# EAGLE design BlueBus (EAGLE 9.6.2)

## Sheet 1 of 5
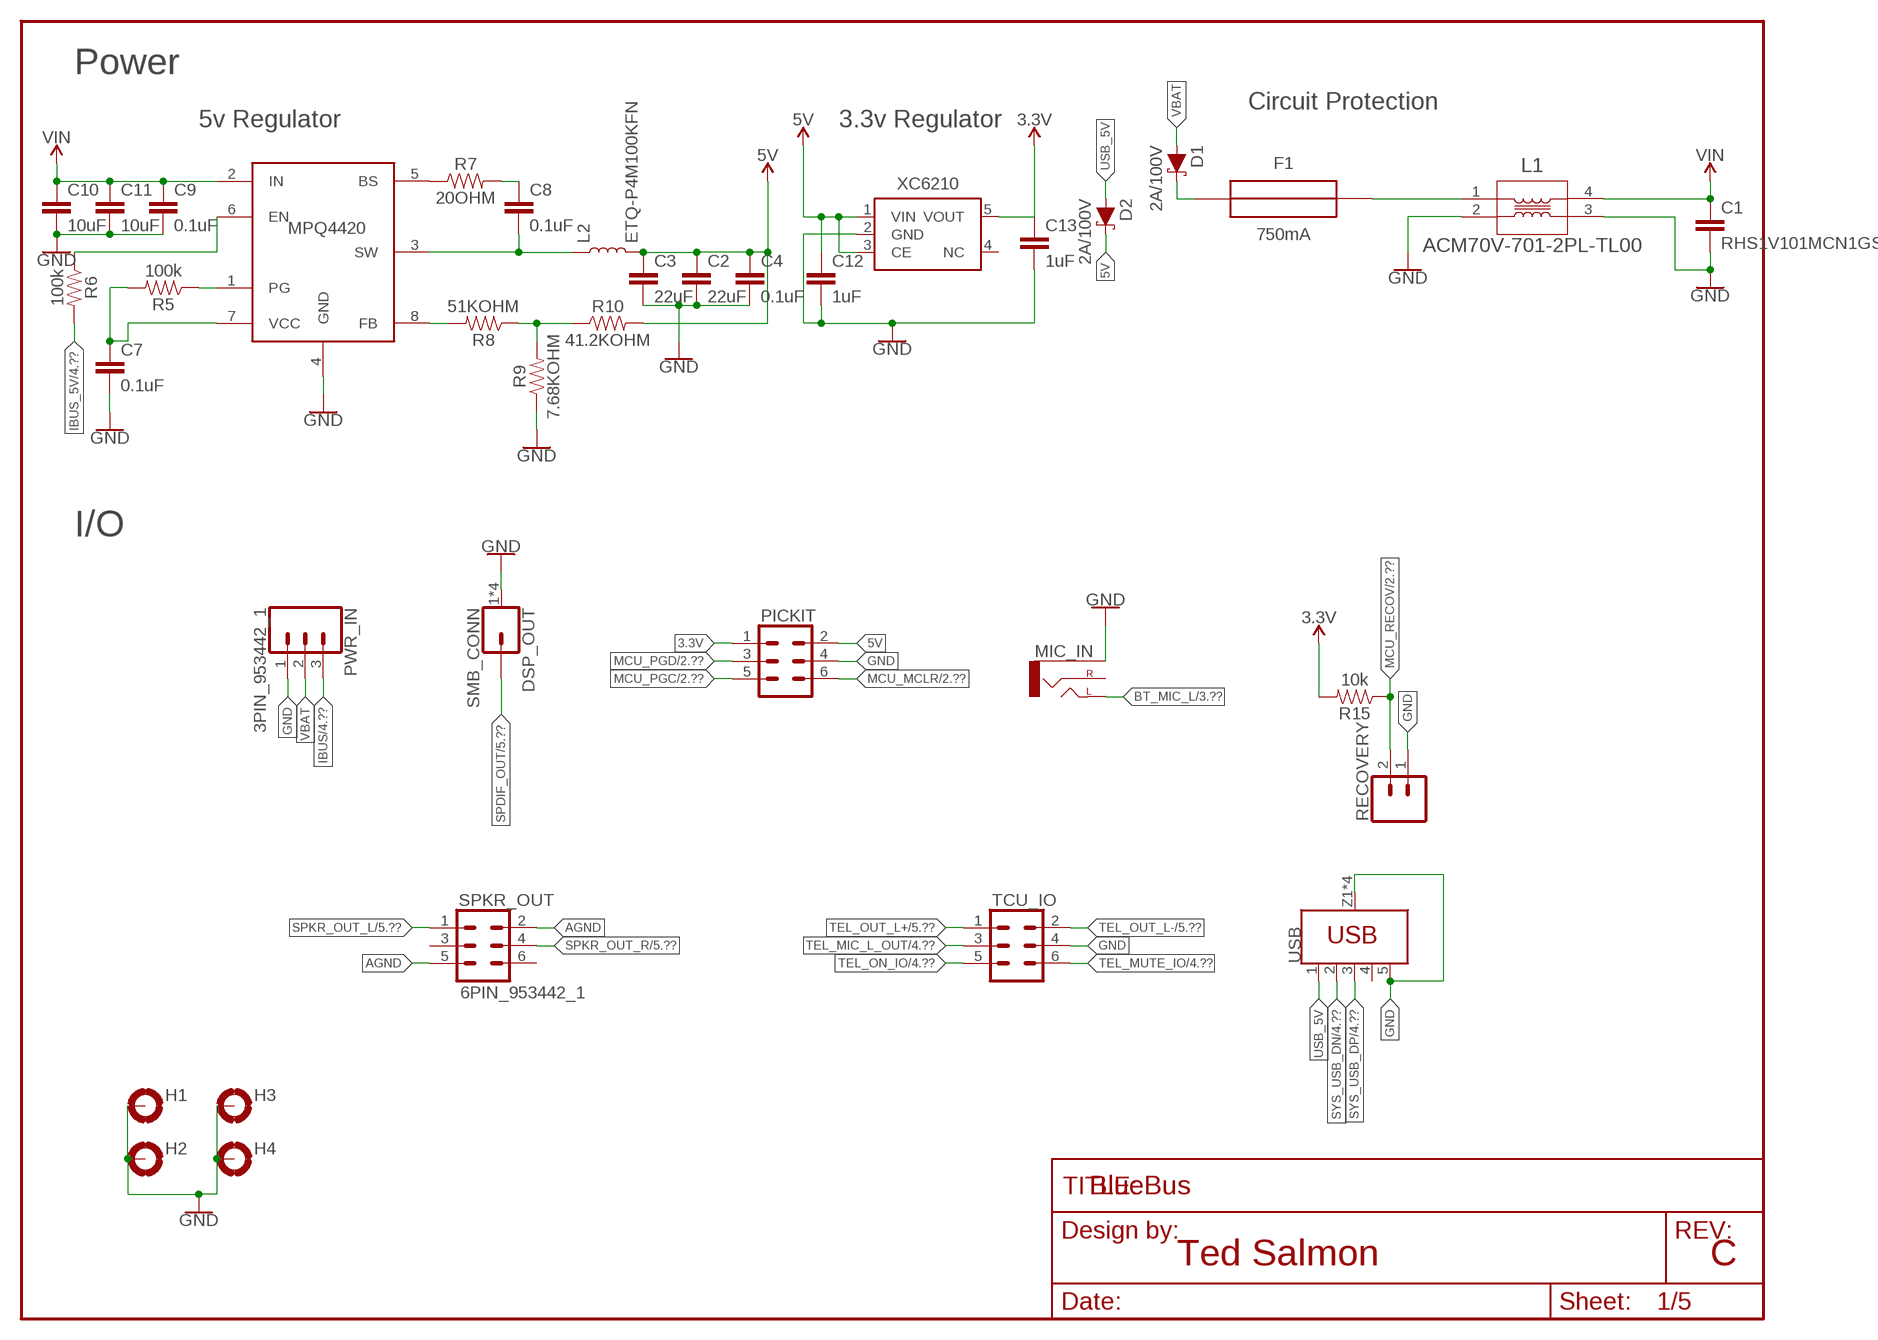
[diagram p0: schematic, sheet 1]

### Parts
C1  RHS1V101MCN1GS  [RHS1V101MCN1GS]
C2  22uF  22UF  [0805]
C3  22uF  22UF  [0805]
C4  0.1uF  0.1UF  [0805]
C7  0.1uF  0.1UF  [0805]
C8  0.1uF  0.1UF  [0805]
C9  0.1uF  0.1UF  [0805]
C10  10uF  10UF  [1206]
C11  10uF  10UF  [1206]
C12  1uF  1UF  [0805]
C13  1uF  1UF  [0805]
D1  2A/100V  SCHOTTKYDIODE2A100V  [SOD123]
D2  2A/100V  SCHOTTKYDIODE2A100V  [SOD123]
DSP_OUT  SMB_CONN  [MOLEX_SMB]
F1  750mA  LITTLEBLOCK_FUSE_.75A  [LITTLEFUSE]
FRAME1  FRAME-LETTER  [DUMMY]
H1  2,0-PAD  [2.0-PAD]
H2  2,0-PAD  [2.0-PAD]
H3  2,0-PAD  [2.0-PAD]
H4  2,0-PAD  [2.0-PAD]
L1  ACM70V-701-2PL-TL00  [ACM70V-701-2PL-TL00]
L2  ETQ-P4M100KFN  [PCC-M0648M-LE]
MIC_IN  AUDIO-CUI-SJ-3523-SMT  [AUDIO-CUI-SJ-352X-SMT]
MPQ4420  MPQ4420  [TSOT23-8]
PICKIT  6PIN_JUMPER  [2X3]
PWR_IN  3PIN_953442_1  [TE_MQS_3PIN]
R5  100k  100KOHM  [0805]
R6  100k  100KOHM  [0805]
R7  20OHM  [0805]
R8  51KOHM  [0805]
R9  7.68KOHM  [0805]
R10  41.2KOHM  [0805]
R15  10k  10KOHM  [0805]
RECOVERY  2PIN_JUMPER  [1X02]
SPKR_OUT  6PIN_953442_1  [TE_MQS_6PIN]
TCU_IO  6PIN_5_103166_1  [TE_AMPMODU_6_PIN]
USB  USB_WURTH_629105150521  [629105150521]
XC6210  XC6210SOT25  [SOT23-5]

### Nets
3.3V [3.3V]: C13.1 PICKIT.1 R15.2 XC6210.5(VOUT) ; also sheet 2,3,4,5
5V [USB_5V]: C2.1 C3.1 C4.1 C12.1 D2.C L2.2 PICKIT.2 R10.2 XC6210.1(VIN) XC6210.3(CE) ; also sheet 4,5
5VREG_BS: MPQ4420.5(BS) R7.1
5VREG_BS_CAP: C8.1 R7.2
5VREG_EN: MPQ4420.6(EN) R6.1
5VREG_FB: MPQ4420.8(FB) R8.2
5VREG_FB_T: R8.1 R9.2 R10.1
5VREG_PG: MPQ4420.1(PG) R5.1
5VREG_SW: C8.2 L2.1 MPQ4420.3(SW)
5VREG_VCC: C7.1 MPQ4420.7(VCC) R5.2
AGND: SPKR_OUT.2 SPKR_OUT.5 ; also sheet 5
BT_MIC_L: MIC_IN.TIP(LEFT) ; also sheet 3,4
GND: C1.2 C2.2 C3.2 C4.2 C7.2 C9.2 C10.2 C11.2 C12.2 C13.2 DSP_OUT.1(GND) DSP_OUT.2(GND) DSP_OUT.3(GND) DSP_OUT.4(GND) H1.B2,0(MOUNT) H2.B2,0(MOUNT) H3.B2,0(MOUNT) H4.B2,0(MOUNT) L1.2 L1.3 MIC_IN.SLEEVE MPQ4420.4(GND) PICKIT.4 PWR_IN.1 R9.1 RECOVERY.1 TCU_IO.4 USB.5(GND) USB.Z1(SHIELD) USB.Z2(SHIELD) USB.Z3(SHIELD) USB.Z4(SHIELD) XC6210.2(GND) ; also sheet 2,3,4,5
IBUS [Data]: PWR_IN.3 ; also sheet 4
IBUS_5V: R6.2 ; also sheet 4
MCU_MCLR [MCU_Data]: PICKIT.6 ; also sheet 2
MCU_PGC [MCU_Data]: PICKIT.5 ; also sheet 2
MCU_PGD [MCU_Data]: PICKIT.3 ; also sheet 2
MCU_RECOV [MCU_Data]: R15.1 RECOVERY.2 ; also sheet 2
SPDIF_OUT: DSP_OUT.P$1 ; also sheet 5
SPKR_OUT_L: SPKR_OUT.1 ; also sheet 5
SPKR_OUT_R: SPKR_OUT.4 ; also sheet 5
SYS_USB_DN [Data]: USB.2(D-) ; also sheet 4
SYS_USB_DP [Data]: USB.3(D+) ; also sheet 4
TEL_MIC_L_OUT: TCU_IO.3 ; also sheet 4
TEL_MUTE_IO: TCU_IO.6 ; also sheet 4
TEL_ON_IO: TCU_IO.5 ; also sheet 4
TEL_OUT_L+: TCU_IO.1 ; also sheet 5
TEL_OUT_L-: TCU_IO.2 ; also sheet 5
USB_5V: D2.A USB.1(VBUS)
VBAT: D1.A PWR_IN.2
VBAT_DIODE: D1.C F1.IN(OUT)
VBAT_FUSE: F1.OUT(IN) L1.1
VIN [VIN]: C1.1 C9.1 C10.1 C11.1 L1.4 MPQ4420.2(IN) ; also sheet 4
Unconnected: MIC_IN.RING(RIGHT) SPKR_OUT.3 SPKR_OUT.6 USB.4(ID) XC6210.4(NC)

### Notes on the sheet
- Power
- Circuit Protection
- 5v Regulator | 3.3v Regulator
- I/O
- Ted Salmon | C

## Sheet 2 of 5
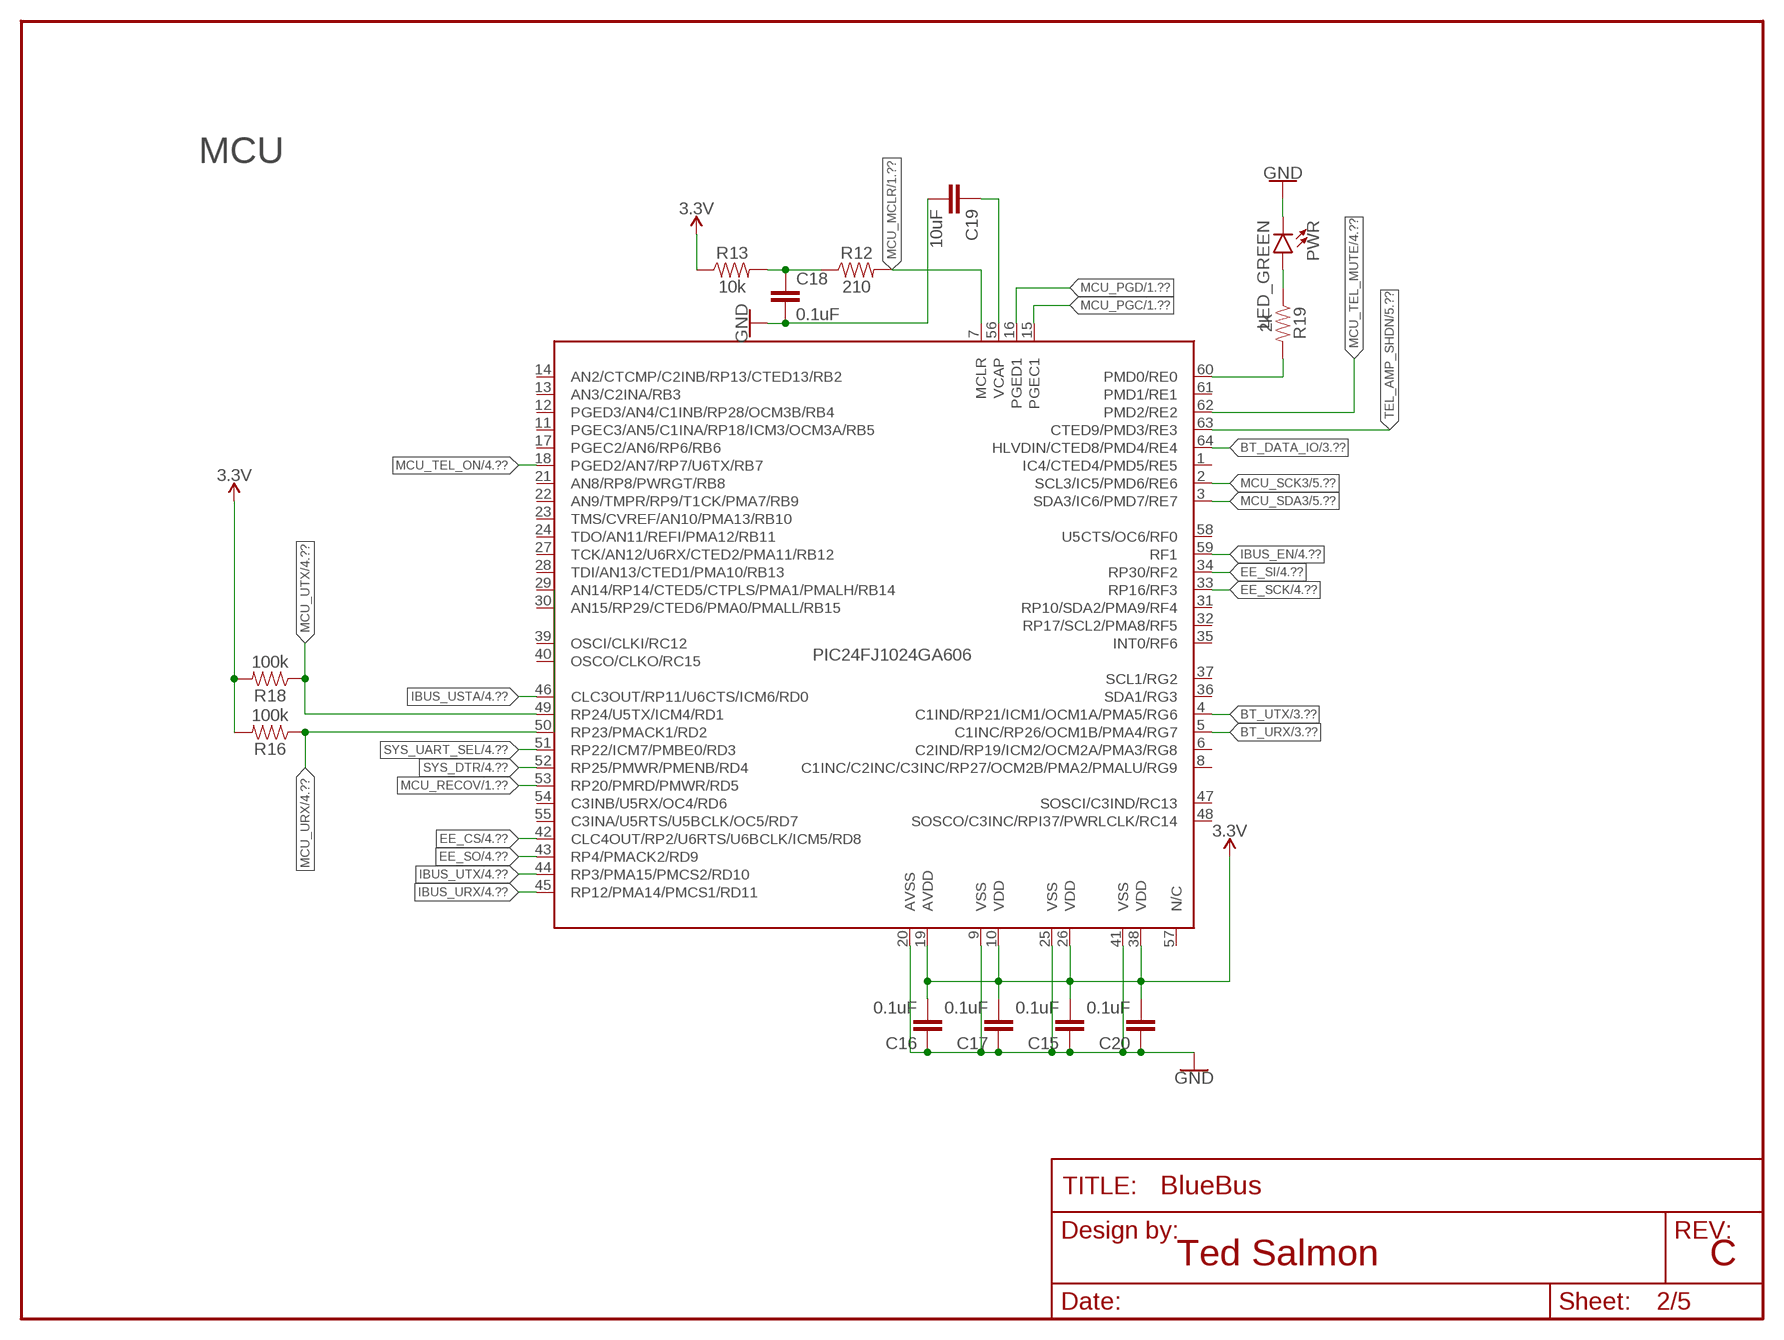
[diagram p1: schematic, sheet 2]

### Parts
C15  0.1uF  0.1UF  [0805]
C16  0.1uF  0.1UF  [0805]
C17  0.1uF  0.1UF  [0805]
C18  0.1uF  0.1UF  [0805]
C19  10uF  10UF2012  [0805]
C20  0.1uF  0.1UF  [0805]
FRAME2  FRAME-LETTER  [DUMMY]
PIC24FJ1024GA606  PIC24FJ1024GA606  [TQFP64]
PWR  LED_GREEN  [LED-0805]
R12  210  210OHM  [0805]
R13  10k  10KOHM  [0805]
R16  100k  100KOHM  [0805]
R18  100k  100KOHM  [0805]
R19  2k  2KOHM  [0805]

### Nets
3.3V [3.3V]: C15.2 C16.2 C17.2 C20.2 PIC24FJ1024GA606.10(VDD) PIC24FJ1024GA606.19(AVDD) PIC24FJ1024GA606.26(VDD) PIC24FJ1024GA606.38(VDD) R13.1 R16.2 R18.2 ; also sheet 1,3,4,5
BT_DATA_IO [MCU_Data]: PIC24FJ1024GA606.64(HLVDIN/CTED8/PMD4/RE4) ; also sheet 3
BT_URX [MCU_Data]: PIC24FJ1024GA606.5(C1INC/RP26/OCM1B/PMA4/RG7) ; also sheet 3,4
BT_UTX [MCU_Data]: PIC24FJ1024GA606.4(C1IND/RP21/ICM1/OCM1A/PMA5/RG6) ; also sheet 3,4
EE_CS [MCU_Data]: PIC24FJ1024GA606.42(CLC4OUT/RP2/U6RTS/U6BCLK/ICM5/RD8) ; also sheet 4
EE_SCK [MCU_Data]: PIC24FJ1024GA606.33(RP16/RF3) ; also sheet 4
EE_SI [MCU_Data]: PIC24FJ1024GA606.34(RP30/RF2) ; also sheet 4
EE_SO [MCU_Data]: PIC24FJ1024GA606.43(RP4/PMACK2/RD9) ; also sheet 4
GND: C15.1 C16.1 C17.1 C18.2 C19.2 C20.1 PIC24FJ1024GA606.9(VSS) PIC24FJ1024GA606.20(AVSS) PIC24FJ1024GA606.25(VSS) PIC24FJ1024GA606.41(VSS) PWR.-(C) ; also sheet 1,3,4,5
IBUS_EN [MCU_Data]: PIC24FJ1024GA606.59(RF1) ; also sheet 4
IBUS_URX [MCU_Data]: PIC24FJ1024GA606.45(RP12/PMA14/PMCS1/RD11) ; also sheet 4
IBUS_USTA [MCU_Data]: PIC24FJ1024GA606.46(CLC3OUT/RP11/U6CTS/ICM6/RD0) ; also sheet 4
IBUS_UTX [MCU_Data]: PIC24FJ1024GA606.44(RP3/PMA15/PMCS2/RD10) ; also sheet 4
MCU_MCLR [MCU_Data]: PIC24FJ1024GA606.7(MCLR) R12.2 ; also sheet 1
MCU_MCLR_RES [MCU_Data]: C18.1 R12.1 R13.2
MCU_ON_LED [MCU_Data]: PIC24FJ1024GA606.60(PMD0/RE0) R19.2
MCU_ON_LED_RES: PWR.+(A) R19.1
MCU_PGC [MCU_Data]: PIC24FJ1024GA606.15(PGEC1) ; also sheet 1
MCU_PGD [MCU_Data]: PIC24FJ1024GA606.16(PGED1) ; also sheet 1
MCU_RECOV [MCU_Data]: PIC24FJ1024GA606.53(RP20/PMRD/PMWR/RD5) ; also sheet 1
MCU_SCK3 [MCU_Data]: PIC24FJ1024GA606.2(SCL3/IC5/PMD6/RE6) ; also sheet 5
MCU_SDA3 [MCU_Data]: PIC24FJ1024GA606.3(SDA3/IC6/PMD7/RE7) ; also sheet 5
MCU_TEL_MUTE [MCU_Data]: PIC24FJ1024GA606.62(PMD2/RE2) ; also sheet 4
MCU_TEL_ON [MCU_Data]: PIC24FJ1024GA606.18(PGED2/AN7/RP7/U6TX/RB7) ; also sheet 4
MCU_URX [MCU_Data]: PIC24FJ1024GA606.50(RP23/PMACK1/RD2) R16.1 ; also sheet 4
MCU_UTX [MCU_Data]: PIC24FJ1024GA606.49(RP24/U5TX/ICM4/RD1) R18.1 ; also sheet 4
MCU_VCAP [MCU_Data]: C19.1 PIC24FJ1024GA606.56(VCAP)
SYS_DTR [MCU_Data]: PIC24FJ1024GA606.52(RP25/PMWR/PMENB/RD4) ; also sheet 4
SYS_UART_SEL [MCU_Data]: PIC24FJ1024GA606.51(RP22/ICM7/PMBE0/RD3) ; also sheet 4
TEL_AMP_SHDN [MCU_Data]: PIC24FJ1024GA606.63(CTED9/PMD3/RE3) ; also sheet 5
Unconnected: PIC24FJ1024GA606.1(IC4/CTED4/PMD5/RE5) PIC24FJ1024GA606.6(C2IND/RP19/ICM2/OCM2A/PMA3/RG8) PIC24FJ1024GA606.8(C1INC/C2INC/C3INC/RP27/OCM2B/PMA2/PMALU/RG9) PIC24FJ1024GA606.11(PGEC3/AN5/C1INA/RP18/ICM3/OCM3A/RB5) PIC24FJ1024GA606.12(PGED3/AN4/C1INB/RP28/OCM3B/RB4) PIC24FJ1024GA606.13(AN3/C2INA/RB3) PIC24FJ1024GA606.14(AN2/CTCMP/C2INB/RP13/CTED13/RB2) PIC24FJ1024GA606.17(PGEC2/AN6/RP6/RB6) PIC24FJ1024GA606.21(AN8/RP8/PWRGT/RB8) PIC24FJ1024GA606.22(AN9/TMPR/RP9/T1CK/PMA7/RB9) PIC24FJ1024GA606.23(TMS/CVREF/AN10/PMA13/RB10) PIC24FJ1024GA606.24(TDO/AN11/REFI/PMA12/RB11) PIC24FJ1024GA606.27(TCK/AN12/U6RX/CTED2/PMA11/RB12) PIC24FJ1024GA606.28(TDI/AN13/CTED1/PMA10/RB13) PIC24FJ1024GA606.29(AN14/RP14/CTED5/CTPLS/PMA1/PMALH/RB14) PIC24FJ1024GA606.30(AN15/RP29/CTED6/PMA0/PMALL/RB15) PIC24FJ1024GA606.31(RP10/SDA2/PMA9/RF4) PIC24FJ1024GA606.32(RP17/SCL2/PMA8/RF5) PIC24FJ1024GA606.35(INT0/RF6) PIC24FJ1024GA606.36(SDA1/RG3) PIC24FJ1024GA606.37(SCL1/RG2) PIC24FJ1024GA606.39(OSCI/CLKI/RC12) PIC24FJ1024GA606.40(OSCO/CLKO/RC15) PIC24FJ1024GA606.47(SOSCI/C3IND/RC13) PIC24FJ1024GA606.48(SOSCO/C3INC/RPI37/PWRLCLK/RC14) PIC24FJ1024GA606.54(C3INB/U5RX/OC4/RD6) PIC24FJ1024GA606.55(C3INA/U5RTS/U5BCLK/OC5/RD7) PIC24FJ1024GA606.57(N/C) PIC24FJ1024GA606.58(U5CTS/OC6/RF0) PIC24FJ1024GA606.61(PMD1/RE1)

### Notes on the sheet
- MCU
- Ted Salmon | C

## Sheet 3 of 5
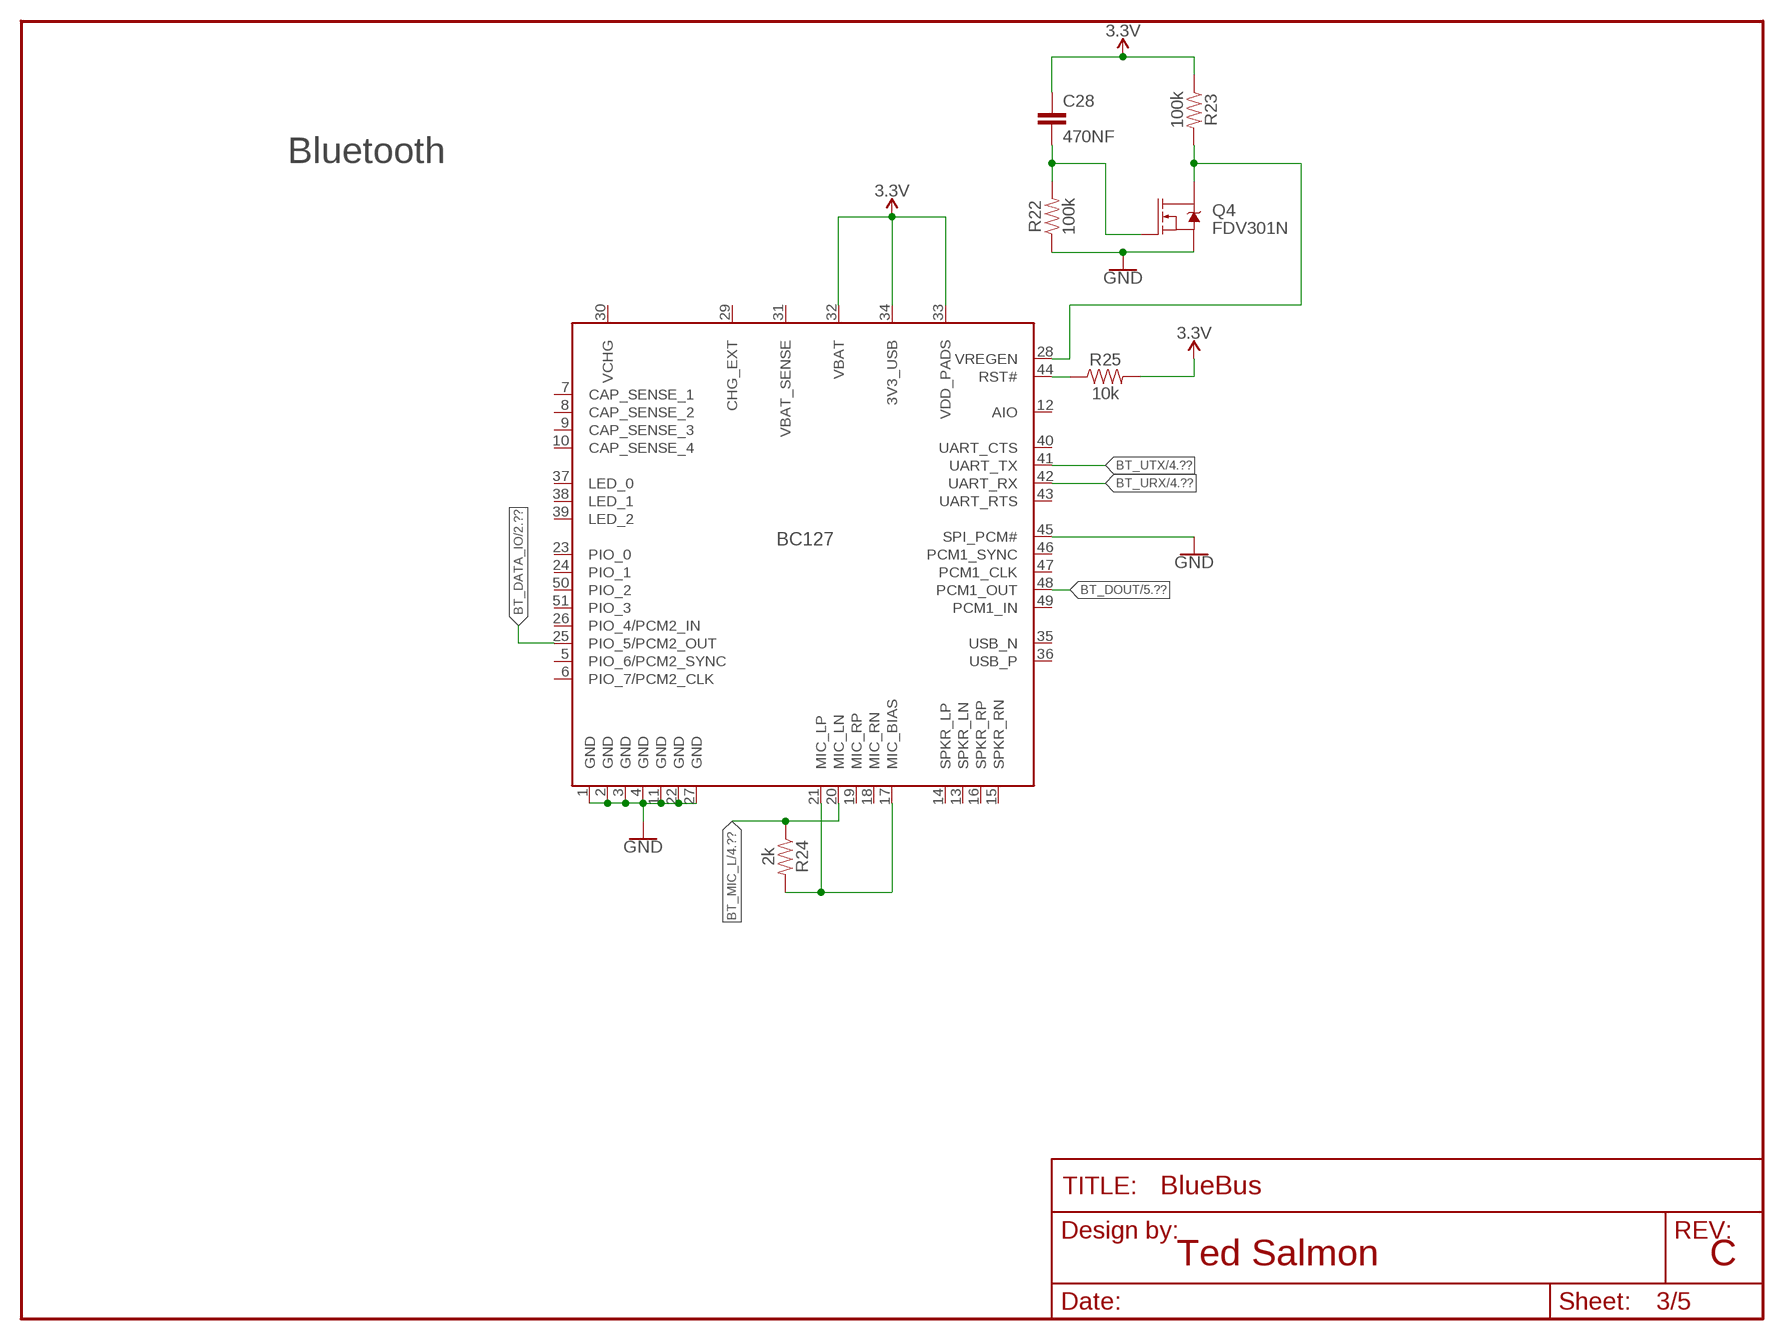
[diagram p2: schematic, sheet 3]

### Parts
BC127  BC127  [BC127]
C28  470NF  [0805]
FRAME4  FRAME-LETTER  [DUMMY]
Q4  FDV301N  [SOT-23]
R22  100k  100KOHM  [0805]
R23  100k  100KOHM  [0805]
R24  2k  2KOHM  [0805]
R25  10k  10KOHM  [0805]

### Nets
3.3V [3.3V]: BC127.32(VBAT) BC127.33(VDD_PADS) BC127.34(3V3_USB) C28.1 R23.1 R25.2 ; also sheet 1,2,4,5
BT_DATA_IO [MCU_Data]: BC127.25(PIO_5/PCM2_OUT) ; also sheet 2
BT_DOUT: BC127.48(PCM1_OUT) ; also sheet 5
BT_MIC_BIAS: BC127.17(MIC_BIAS) BC127.21(MIC_LP) R24.2
BT_MIC_L: BC127.20(MIC_LN) R24.1 ; also sheet 1,4
BT_RST: BC127.44(RST#) R25.1
BT_URX [MCU_Data]: BC127.42(UART_RX) ; also sheet 2,4
BT_UTX [MCU_Data]: BC127.41(UART_TX) ; also sheet 2,4
BT_VREGEN: BC127.28(VREGEN) Q4.3(D) R23.2
BT_VREGEN_CAP_GATE: C28.2 Q4.1(G) R22.2
GND: BC127.1(GND) BC127.2(GND) BC127.3(GND) BC127.4(GND) BC127.11(GND) BC127.22(GND) BC127.27(GND) BC127.45(SPI_PCM#) Q4.2(S) R22.1 ; also sheet 1,2,4,5
Unconnected: BC127.5(PIO_6/PCM2_SYNC) BC127.6(PIO_7/PCM2_CLK) BC127.7(CAP_SENSE_1) BC127.8(CAP_SENSE_2) BC127.9(CAP_SENSE_3) BC127.10(CAP_SENSE_4) BC127.12(AIO) BC127.13(SPKR_LN) BC127.14(SPKR_LP) BC127.15(SPKR_RN) BC127.16(SPKR_RP) BC127.18(MIC_RN) BC127.19(MIC_RP) BC127.23(PIO_0) BC127.24(PIO_1) BC127.26(PIO_4/PCM2_IN) BC127.35(USB_N) BC127.36(USB_P) BC127.37(LED_0) BC127.38(LED_1) BC127.39(LED_2) BC127.40(UART_CTS) BC127.43(UART_RTS) BC127.46(PCM1_SYNC) BC127.47(PCM1_CLK) BC127.49(PCM1_IN) BC127.50(PIO_2) BC127.51(PIO_3)

### Notes on the sheet
- Bluetooth
- Ted Salmon | C

## Sheet 4 of 5
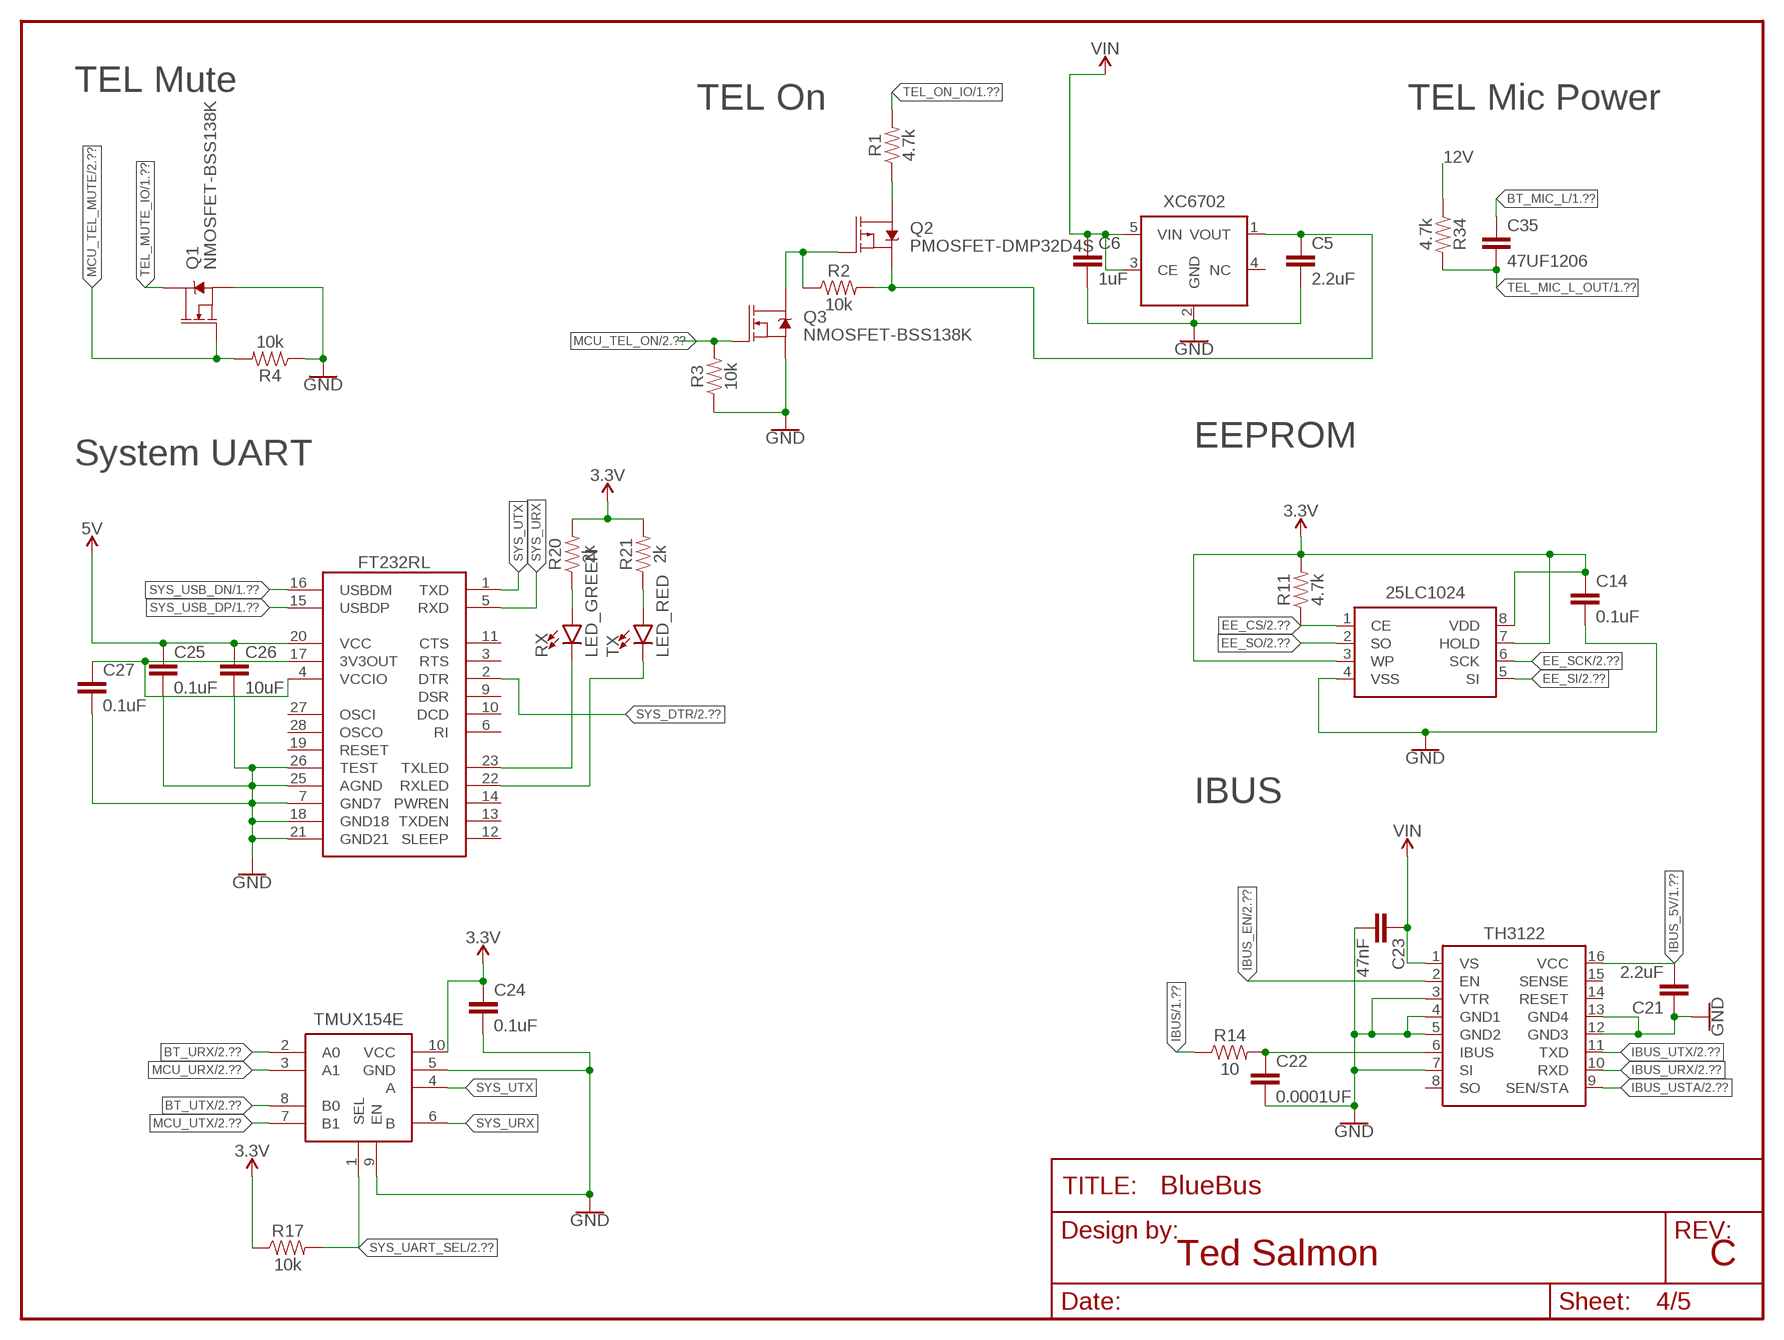
[diagram p3: schematic, sheet 4]

### Parts
25LC1024  25LC1024  [SOIJ-8]
C5  2.2uF  2.2UF  [0805]
C6  1uF  1UF  [0805]
C14  0.1uF  0.1UF  [0805]
C21  2.2uF  2.2UF  [0805]
C22  0.0001UF  [0805]
C23  47nF  47NF  [0805]
C24  0.1uF  0.1UF  [0805]
C25  0.1uF  0.1UF  [0805]
C26  10uF  10UF2012  [0805]
C27  0.1uF  0.1UF  [0805]
C35  47UF1206  [1206]
FRAME3  FRAME-LETTER  [DUMMY]
FT232RL  FT232RL  [SSOP28]
Q1  NMOSFET-BSS138K  [SOT-23]
Q2  PMOSFET-DMP32D4S  [SOT-23]
Q3  NMOSFET-BSS138K  [SOT-23]
R1  4.7k  4.7KOHM  [0805]
R2  10k  10KOHM  [0805]
R3  10k  10KOHM  [0805]
R4  10k  10KOHM  [0805]
R11  4.7k  4.7KOHM  [0805]
R14  10  10OHM  [0805]
R17  10k  10KOHM  [0805]
R20  2k  2KOHM  [0805]
R21  2k  2KOHM  [0805]
R34  4.7k  4.7KOHM  [0805]
RX  LED_GREEN  [LED-0805]
TH3122  TH3122.4  [SOIC16DF]
TMUX154E  TMUX154E  [VSSOP10]
TX  LED_RED  [LED-0805]
XC6702  XC6702DC018PR-G  [SOT-89-5]

### Nets
3.3V [3.3V]: 25LC1024.3(WP) 25LC1024.7(HOLD) 25LC1024.8(VDD) C14.1 C24.1 R11.2 R17.1 R20.2 R21.2 TMUX154E.10(VCC) ; also sheet 1,2,3,5
5V [USB_5V]: C25.1 C26.1 FT232RL.20(VCC) ; also sheet 1,5
12V [VIN]: C5.1 Q2.2(S) R2.2 R34.1 XC6702.1(VOUT)
BT_MIC_L: C35.1 ; also sheet 1,3
BT_URX [MCU_Data]: TMUX154E.2(A0) ; also sheet 2,3
BT_UTX [MCU_Data]: TMUX154E.8(B0) ; also sheet 2,3
EE_CS [MCU_Data]: 25LC1024.1(CE) R11.1 ; also sheet 2
EE_SCK [MCU_Data]: 25LC1024.6(SCK) ; also sheet 2
EE_SI [MCU_Data]: 25LC1024.5(SI) ; also sheet 2
EE_SO [MCU_Data]: 25LC1024.2(SO) ; also sheet 2
GND: 25LC1024.4(VSS) C5.2 C6.2 C14.2 C21.1 C22.2 C23.2 C24.2 C25.2 C26.2 C27.2 FT232RL.7(GND7) FT232RL.18(GND18) FT232RL.21(GND21) FT232RL.25(AGND) FT232RL.26(TEST) Q1.2(S) Q3.2(S) R3.1 R4.1 TH3122.3(VTR) TH3122.4(GND1) TH3122.5(GND2) TH3122.7(SI) TH3122.12(GND3) TH3122.13(GND4) TMUX154E.5(GND) TMUX154E.9(EN) XC6702.2(GND) ; also sheet 1,2,3,5
IBUS [Data]: R14.1 ; also sheet 1
IBUS_5V: C21.2 TH3122.16(VCC) ; also sheet 1
IBUS_EN [MCU_Data]: TH3122.2(EN) ; also sheet 2
IBUS_FILT: C22.1 R14.2 TH3122.6(IBUS)
IBUS_URX [MCU_Data]: TH3122.10(RXD) ; also sheet 2
IBUS_USTA [MCU_Data]: TH3122.9(SEN/STA) ; also sheet 2
IBUS_UTX [MCU_Data]: TH3122.11(TXD) ; also sheet 2
MCU_TEL_MUTE [MCU_Data]: Q1.1(G) R4.2 ; also sheet 2
MCU_TEL_ON [MCU_Data]: Q3.1(G) R3.2 ; also sheet 2
MCU_URX [MCU_Data]: TMUX154E.3(A1) ; also sheet 2
MCU_UTX [MCU_Data]: TMUX154E.7(B1) ; also sheet 2
RX_LED: FT232RL.23(TXLED) RX.-(C)
RX_LED_RES: R20.1 RX.+(A)
SYS_3V3: C27.1 FT232RL.4(VCCIO) FT232RL.17(3V3OUT)
SYS_DTR [MCU_Data]: FT232RL.2(DTR) ; also sheet 2
SYS_UART_SEL [MCU_Data]: R17.2 TMUX154E.1(SEL) ; also sheet 2
SYS_URX: FT232RL.5(RXD) TMUX154E.6(B)
SYS_USB_DN [Data]: FT232RL.16(USBDM) ; also sheet 1
SYS_USB_DP [Data]: FT232RL.15(USBDP) ; also sheet 1
SYS_UTX: FT232RL.1(TXD) TMUX154E.4(A)
TEL_MIC_L_OUT: C35.2 R34.2 ; also sheet 1
TEL_MUTE_IO: Q1.3(D) ; also sheet 1
TEL_ON: Q2.3(D) R1.1
TEL_ON_EN: Q2.1(G) Q3.3(D) R2.1
TEL_ON_IO: R1.2 ; also sheet 1
TX_LED: FT232RL.22(RXLED) TX.-(C)
TX_LED_RES: R21.1 TX.+(A)
VIN [VIN]: C6.1 C23.1 TH3122.1(VS) XC6702.3(CE) XC6702.5(VIN) ; also sheet 1
Unconnected: FT232RL.3(RTS) FT232RL.6(RI) FT232RL.9(DSR) FT232RL.10(DCD) FT232RL.11(CTS) FT232RL.12(SLEEP) FT232RL.13(TXDEN) FT232RL.14(PWREN) FT232RL.19(RESET) FT232RL.27(OSCI) FT232RL.28(OSCO) TH3122.8(SO) TH3122.14(RESET) TH3122.15(SENSE) XC6702.4(NC)

### Notes on the sheet
- TEL Mute
- TEL On | TEL Mic Power
- EEPROM
- System UART
- IBUS
- Ted Salmon | C

## Sheet 5 of 5
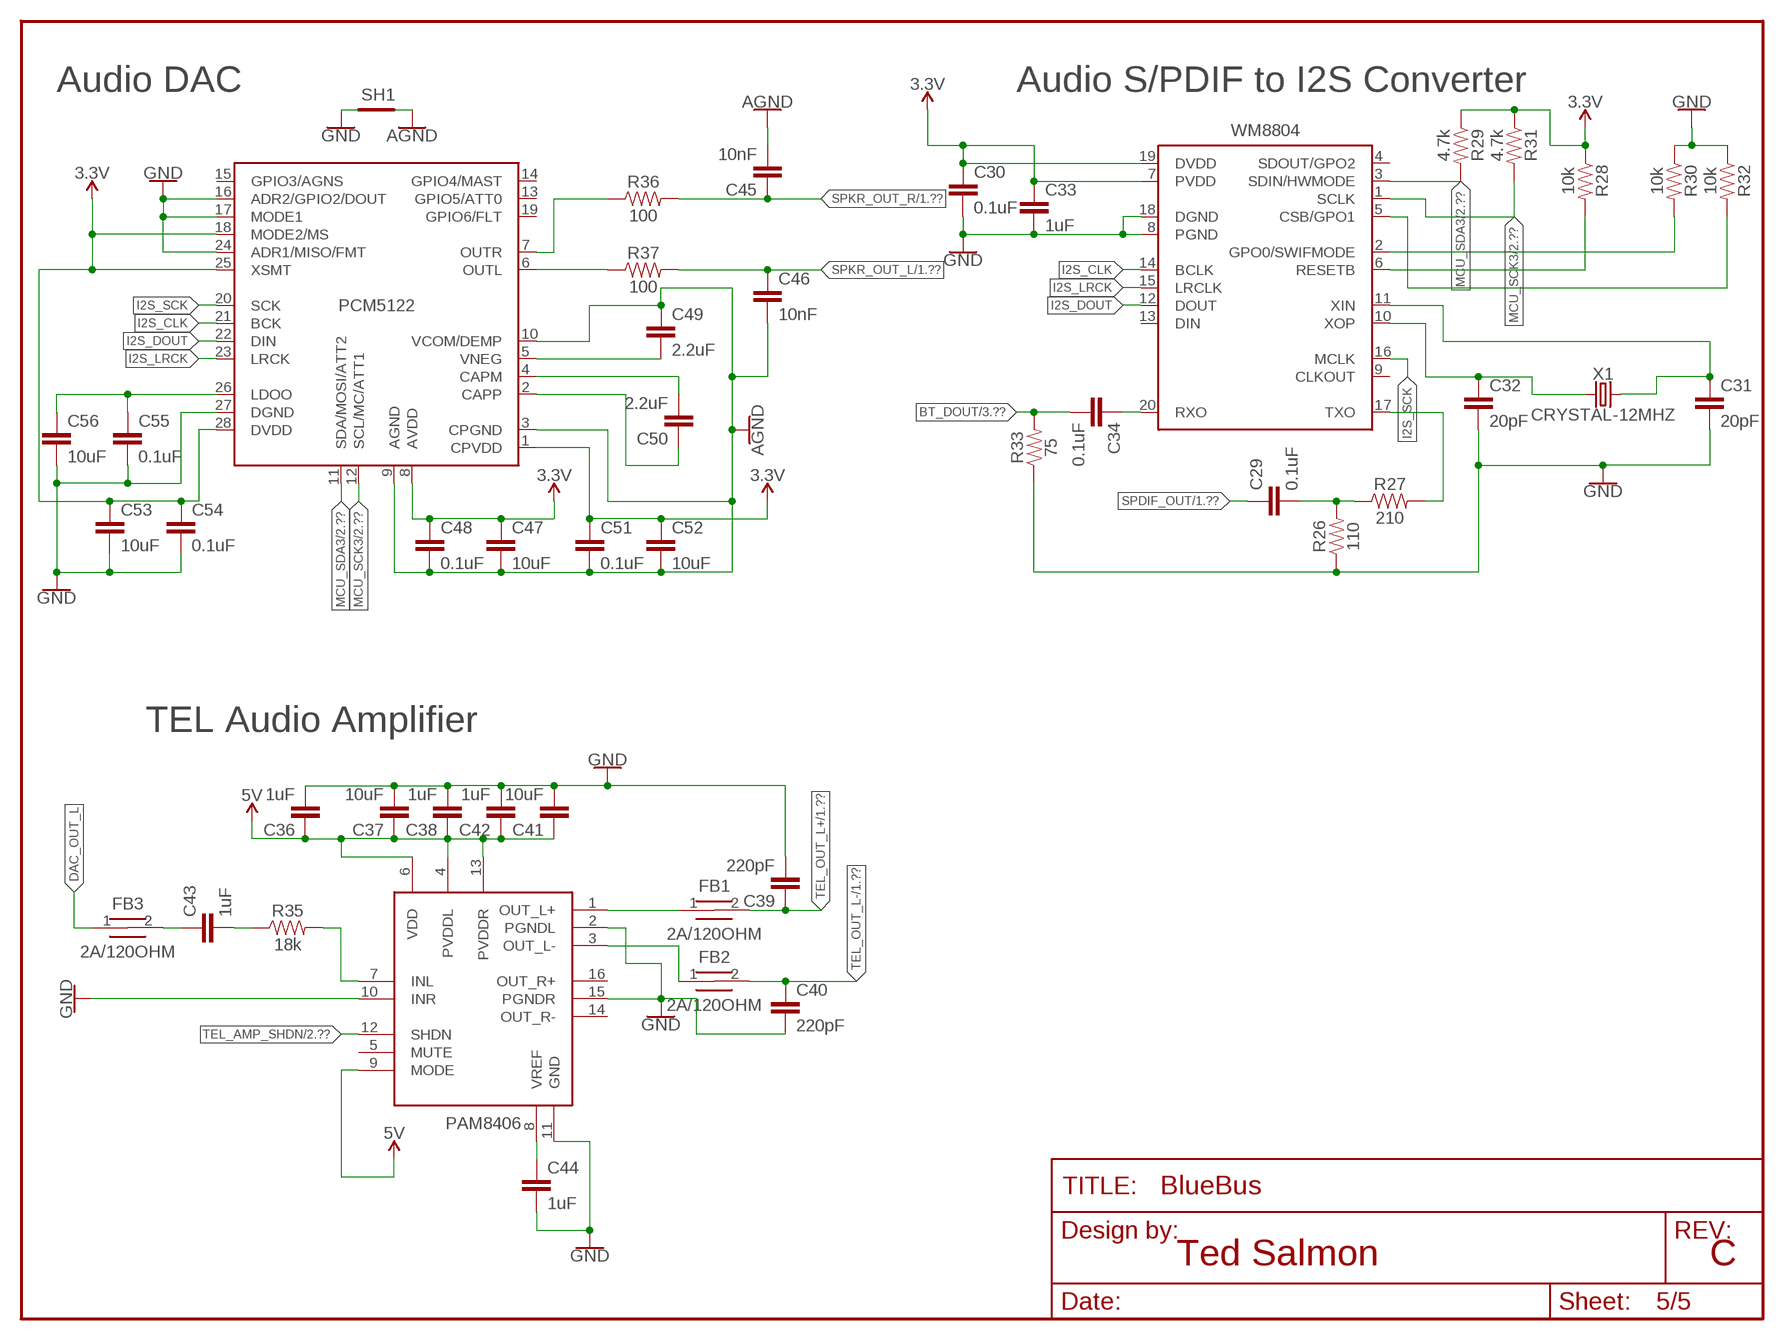
[diagram p4: schematic, sheet 5]

### Parts
C29  0.1uF  0.1UF  [0805]
C30  0.1uF  0.1UF  [0805]
C31  20pF  20PF  [0805]
C32  20pF  20PF  [0805]
C33  1uF  1UF  [0805]
C34  0.1uF  0.1UF  [0805]
C36  1uF  1UF  [0805]
C37  10uF  10UF2012  [0805]
C38  1uF  1UF  [0805]
C39  220pF  220PF  [0805]
C40  220pF  220PF  [0805]
C41  10uF  10UF2012  [0805]
C42  1uF  1UF  [0805]
C43  1uF  1UF  [0805]
C44  1uF  1UF  [0805]
C45  10nF  10NF  [0805]
C46  10nF  10NF  [0805]
C47  10uF  10UF2012  [0805]
C48  0.1uF  0.1UF  [0805]
C49  2.2uF  2.2UF  [0805]
C50  2.2uF  2.2UF  [0805]
C51  0.1uF  0.1UF  [0805]
C52  10uF  10UF2012  [0805]
C53  10uF  10UF2012  [0805]
C54  0.1uF  0.1UF  [0805]
C55  0.1uF  0.1UF  [0805]
C56  10uF  10UF2012  [0805]
FB1  2A/120OHM  FERRITE_2A/120OHM  [0805]
FB2  2A/120OHM  FERRITE_2A/120OHM  [0805]
FB3  2A/120OHM  FERRITE_2A/120OHM  [0805]
FRAME5  FRAME-LETTER  [DUMMY]
PAM8406  PAM8406  [SOP-16]
PCM5122  PCM5122  [TSSOP28]
R26  110  110OHM  [0805]
R27  210  210OHM  [0805]
R28  10k  10KOHM  [0805]
R29  4.7k  4.7KOHM  [0805]
R30  10k  10KOHM  [0805]
R31  4.7k  4.7KOHM  [0805]
R32  10k  10KOHM  [0805]
R33  75  75OHM  [0805]
R35  18k  18KOHM  [0805]
R36  100  100OHM  [0805]
R37  100  100OHM  [0805]
SH1  SHORTT5  [SHORT_TOP-50]
WM8804  WM8804  [SSOP20]
X1  CRYSTAL-12MHZ  [HC49]

### Nets
3.3V [3.3V]: C30.1 C33.1 C47.1 C48.1 C51.1 C52.1 C53.1 C54.1 PCM5122.1(CPVDD) PCM5122.8(AVDD) PCM5122.18(MODE2/MS) PCM5122.25(XSMT) PCM5122.28(DVDD) R28.1 R29.1 R31.1 WM8804.7(PVDD) WM8804.19(DVDD) ; also sheet 1,2,3,4
5V [USB_5V]: C36.1 C37.1 C38.1 C41.1 C42.1 PAM8406.4(PVDDL) PAM8406.6(VDD) PAM8406.9(MODE) PAM8406.13(PVDDR) ; also sheet 1,4
AGND: C45.2 C46.2 C47.2 C48.2 C49.1 C51.2 C52.2 PCM5122.3(CPGND) PCM5122.9(AGND) PCM5122.10(VCOM/DEMP) SH1.2 ; also sheet 1
BT_DOUT: C34.2 R33.2 ; also sheet 3
DAC_CAPM: C50.2 PCM5122.4(CAPM)
DAC_CAPP: C50.1 PCM5122.2(CAPP)
DAC_LDOO: C55.1 C56.1 PCM5122.26(LDOO)
DAC_OUT_L: FB3.1 PCM5122.6(OUTL) R37.1
DAC_OUT_R: PCM5122.7(OUTR) R36.1
DAC_VNEG: C49.2 PCM5122.5(VNEG)
GND: C30.2 C31.2 C32.2 C33.2 C36.2 C37.2 C38.2 C39.2 C40.2 C41.2 C42.2 C44.2 C53.2 C54.2 C55.2 C56.2 PAM8406.2(PGNDL) PAM8406.10(INR) PAM8406.11(GND) PAM8406.15(PGNDR) PCM5122.16(ADR2/GPIO2/DOUT) PCM5122.17(MODE1) PCM5122.24(ADR1/MISO/FMT) PCM5122.27(DGND) R26.1 R30.1 R32.1 R33.1 SH1.1 WM8804.8(PGND) WM8804.18(DGND) ; also sheet 1,2,3,4
I2S_CLK: PCM5122.21(BCK) WM8804.14(BCLK)
I2S_DOUT: PCM5122.22(DIN) WM8804.12(DOUT)
I2S_LRCK: PCM5122.23(LRCK) WM8804.15(LRCLK)
I2S_SCK: PCM5122.20(SCK) WM8804.16(MCLK)
MCU_SCK3 [MCU_Data]: PCM5122.12(SCL/MC/ATT1) R31.2 WM8804.1(SCLK) ; also sheet 2
MCU_SDA3 [MCU_Data]: PCM5122.11(SDA/MOSI/ATT2) R29.2 WM8804.3(SDIN/HWMODE) ; also sheet 2
SPDIF_OUT: C29.1 ; also sheet 1
SPDIF_RX: C34.1 WM8804.20(RXO)
SPKR_OUT_L: C46.1 R37.2 ; also sheet 1
SPKR_OUT_R: C45.1 R36.2 ; also sheet 1
TEL_AMP_IN: C43.1 FB3.2
TEL_AMP_INL: PAM8406.7(INL) R35.2
TEL_AMP_INL_CAP_RES: C43.2 R35.1
TEL_AMP_OUT_L+: FB1.1 PAM8406.1(OUT_L+)
TEL_AMP_OUT_L-: FB2.1 PAM8406.3(OUT_L-)
TEL_AMP_SHDN [MCU_Data]: PAM8406.12(SHDN) ; also sheet 2
TEL_AMP_VREF: C44.1 PAM8406.8(VREF)
TEL_OUT_L+: C39.1 FB1.2 ; also sheet 1
TEL_OUT_L-: C40.1 FB2.2 ; also sheet 1
WM_CSB: R32.2 WM8804.5(CSB/GPO1)
WM_GPO0: R30.2 WM8804.2(GPO0/SWIFMODE)
WM_RESETB: R28.2 WM8804.6(RESETB)
WM_SPDIF_TX_RES: R27.2 WM8804.17(TXO)
WM_SPDIF_TX_RES2: C29.2 R26.2 R27.1
WM_XIN: C31.1 WM8804.11(XIN) X1.2
WM_XOP: C32.1 WM8804.10(XOP) X1.1
Unconnected: PAM8406.5(MUTE) PAM8406.14(OUT_R-) PAM8406.16(OUT_R+) PCM5122.13(GPIO5/ATT0) PCM5122.14(GPIO4/MAST) PCM5122.15(GPIO3/AGNS) PCM5122.19(GPIO6/FLT) WM8804.4(SDOUT/GPO2) WM8804.9(CLKOUT) WM8804.13(DIN)

### Notes on the sheet
- Audio DAC | Audio S/PDIF to I2S Converter
- TEL Audio Amplifier
- Ted Salmon | C

## Power pins joined to a net without a drawn wire
CHG_EXT: BC127.29(CHG_EXT)
VBAT_SENSE: BC127.31(VBAT_SENSE)
VCHG: BC127.30(VCHG)

## Library data of the parts
25LC1024 = ICs:25LC1024
BC127 = ICs:BC127
C1 = Passives:RHS1V101MCN1GS; MFG: Nichicon; PN: RHS1V101MCN1GS
C2 C3 = Passives:22UF; DEVICE: 22uF-0805-6.3v-10%; MFG: TDK; PACKAGE: 0805; PN: C2012X5R0J226K125AB
C4 C7-C9 C14-C18 C20 C24 C25 C27 C29 C30 C34 C48 C51 C54 C55 = Passives:0.1UF: 0.1uF capacitor; DEVICE: 0.1uF-0805-50V; MFG: KEMET; PACKAGE: 0805; PN: C0805C104J5RACAUTO
C5 C21 C49 C50 = Passives:2.2UF: 2.2uF Capacitor; DEVICE: 2.2uF-0805-25V-10%; MFG: TDK; PACKAGE: 0805; PN: CGB4B1X5R1E225K055AC
C6 C12 C13 C33 C36 C38 C42-C44 = Passives:1UF; DEVICE: 1uF-0805-50v-10%; MFG: TDK; PACKAGE: 0805; PN: CGA4J3X7R1H105K125AB
C10 C11 = Passives:10UF: 10uF Capacitor 1206 Package; DEVICE: 10UF-1206-50V-10%; MFG: TDK; PACKAGE: 1206; PN: CGA5L3X5R1H106K160AB
C19 C26 C37 C41 C47 C52 C53 C56 = Passives:10UF: 10uF Capacitor 1206 Package; DEVICE: 10UF-0805-35V-10%; MFG: TDK; PACKAGE: 0805; PN: C2012X5R1V106K125AC
C22 = Passives:0.0001UF: 100pF Capacitor
C23 = Passives:47NF; DEVICE: 47NF-0805-25V; MFG: AVX; PACKAGE: 0805; PN: 08053C473KAT4A
C28 = Passives:470NF
C31 C32 = Passives:20PF; DEVICE: 20pF-0805-50v-5%; PACKAGE: 0805; PN: C0805X200J5GAC7800
C35 = Passives:47UF: 47uF Capacitor; MFG: MURATA; PN: GRM31CR61E476ME44K
C39 C40 = Passives:220PF; DEVICE: 220PF-0805-50V-5%; MFG: KEMET; PACKAGE: 0805; PN: C0805X221J5HACAUTO
C45 C46 = Passives:10NF; DEVICE: 10NF-0805-50V; MFG: KEMET; PACKAGE: 0805; PN: C0805C103J5GEC7210
D1 D2 = Passives:SCHOTTKYDIODE2A100V: 2A / 100v Schottky Diode in SOD123 packaging; MFG: STMicroelectronics; PN: STPS2H100ZFY
DSP_OUT = Connectors:SMB_CONN
F1 = Passives:LITTLEBLOCK_FUSE_.75A: Littlefuse 154 Series Omni-BLOK Fuse; MFG: LITTLEBLOCK; PN: 0154.750DRT
FB1-FB3 = Passives:FERRITE_2A/120OHM; MFG: BOURNS; PN: MH2029-121Y
FRAME1-FRAME5 = Frame:FRAME-LETTER: Schematic Frame - Letter Standard 8.5x11 US Letter frame
FT232RL = ICs:FT232RL: FT232RL
H1-H4 = Connectors:2,0-PAD
L1 = Passives:ACM70V-701-2PL-TL00; MFG: TDK; PN: ACM70V-701-2PL-TL00
L2 = Passives:ETQ-P4M100KFN; MFG: PANASONIC; PN: ETQ-P4M100KFN
MIC_IN = Connectors:AUDIO-CUI-SJ-3523-SMT
MPQ4420 = ICs:MPQ4420
PAM8406 = ICs:PAM8406
PCM5122 = ICs:PCM5122: The PCM512x devices are a family of monolithic CMOS-integrated circuits that include a stereo digitalto-analog converter and additional support circuitry in a small TSSOP package. The PCM512x uses the latest generation of TI’s advanced segment-DAC architecture to achieve excellent dynamic performance and improved tolerance to clock jitter. Members of the PCM512x family integrate preset audio processing functions with programmable coefficients, allowing developers to change the characteristics of the interpolation filter, speaker EQ, dynamic range controls, and average volume control in their products. The PCM512x provides 2.1-VRMS ground-centered outputs, allowing designers to eliminate DC-blocking capacitors on the output, as well as external muting circuits traditionally associated with single supply line drivers. The integrated line driver surpasses all other chargepump-based line drivers by supporting loads down to 1 kΩ. By supporting loads down to 1 kΩ, the PCM512x can essentially drive up to 10 products in parallel (LCD TV, DVDR, AV receivers, and so forth). The integrated PLL on the device removes the requirement for a system clock (commonly known as master clock), allowing a 3-wire I 2S connection, along with reducing system EMI.
PIC24FJ1024GA606 = ICs:PIC24FJ1024GA606
PICKIT = Connectors:6PIN_JUMPER
PWR RX = Passives:LED_GREEN: 0805 Green LED
PWR_IN = Connectors:3PIN_953442_1
Q1 Q3 = Passives:NMOSFET-BSS138K
Q2 = Passives:PMOSFET-DMP32D4S; MFG: Diodes Inc; MPN: DMP32D4S
Q4 = Passives:FDV301N
R1 R11 R29 R31 R34 = Passives:4.7KOHM; DEVICE: 4.7kOHM-0805-1/8-1%; MFG: Panasonic; PACKAGE: 0805; PN: ERJ-6ENF4701V
R2-R4 R13 R15 R17 R25 R28 R30 R32 = Passives:10KOHM: 10K Ohm Resistor; DEVICE: 10KOHM-0805-1/8-1%; MFG: Panasonic; PACKAGE: 0805; PN: ERJ-6ENF1002V
R5 R6 R16 R18 R22 R23 = Passives:100KOHM: 100k Ohm Resistor; DEVICE: 100KOHM-0805-1/8-1%; PN: ERJ-6ENF1003V
R7 = Passives:20OHM
R8 = Passives:51KOHM
R9 = Passives:7.68KOHM
R10 = Passives:41.2KOHM
R12 R27 = Passives:210OHM
R14 = Passives:10OHM; DEVICE: 10OHM-0805-1/8-1%; MFG: Panasonic; PACKAGE: 0805; PN: ERJ-S06F10R0V
R19-R21 R24 = Passives:2KOHM: 2K Ohm Resistor; DEVICE: 2KOHM-0805-.4-1%; MFG: ROHM; PACKAGE: 0805; PN: ESR10EZPF2001
R26 = Passives:110OHM
R33 = Passives:75OHM; DEVICE: 75OHM-0805-1/2-1%; MFG: Panasonic; PN: ERJ-P06F75R0V
R35 = Passives:18KOHM; DEVICE: 18KOHM-0805-1/8-1%; MFG: Panasonic; PACKAGE: 0805; PN: ERJ-6ENF1802V
R36 R37 = Passives:100OHM; MFG: PANASONIC; PN: ERA-6AED101V
RECOVERY = Connectors:2PIN_JUMPER
SH1 = shorts:SHORT: Short between two nets; BOM: no
SPKR_OUT = Connectors:6PIN_953442_1: TE Conenctivity 953442-1 6-pin Header with Pinholes
TCU_IO = Connectors:6PIN_5_103166_1
TH3122 = ICs:TH3122.4: The TH3122 consists of a low drop voltage regulator 5V/100mA and a K-Bus transceiver. The transceiver is suitable for K-Bus systems conform to ISO 9141.
TMUX154E = ICs:TMUX154E: TMUX154E
TX = Passives:LED_RED: 0805 Red LED
USB = Connectors:USB_WURTH_629105150521
WM8804 = ICs:WM8804: S/PDIF Transciever Supply Voltage Range: 2.7V to 3.6V Interface Type: Serial, 2 / 3 Wire Supply Current: 14.9mA
X1 = Passives:CRYSTAL-12MHZ; PN: LFXTAL035293REEL
XC6210 = ICs:XC6210: 3.3v Voltage Regulator The XC6210 series are precise, low noise, high current, positive voltage low dropout regulators. They are fabricated using Torex’s CMOS process. The series features a voltage reference, an error amplifier, a current limiter, and a phase compensation circuit plus a driver transistor. With a low ON resistance driver transistor built into, batteries can be used until input-output voltage differential is minimal and can accordingly be used for a longer time.
XC6702 = ICs:XC6702DC018PR-G

## Net classes
0 default: width 0.25 mm, drill 0.51 mm
1 5V: width 0.55 mm, drill 0.51 mm
2 3.3V: width 0.22 mm, drill 0.51 mm
3 VIN: width 0.3 mm, drill 0.51 mm
4 Data: width 0.25 mm, drill 0.51 mm
5 MCU_Data: width 0.22 mm, drill 0.51 mm
6 USB_5V: width 0.25 mm, drill 0.51 mm
7 MCU_3V3: width 0.22 mm, drill 0.51 mm

## Board
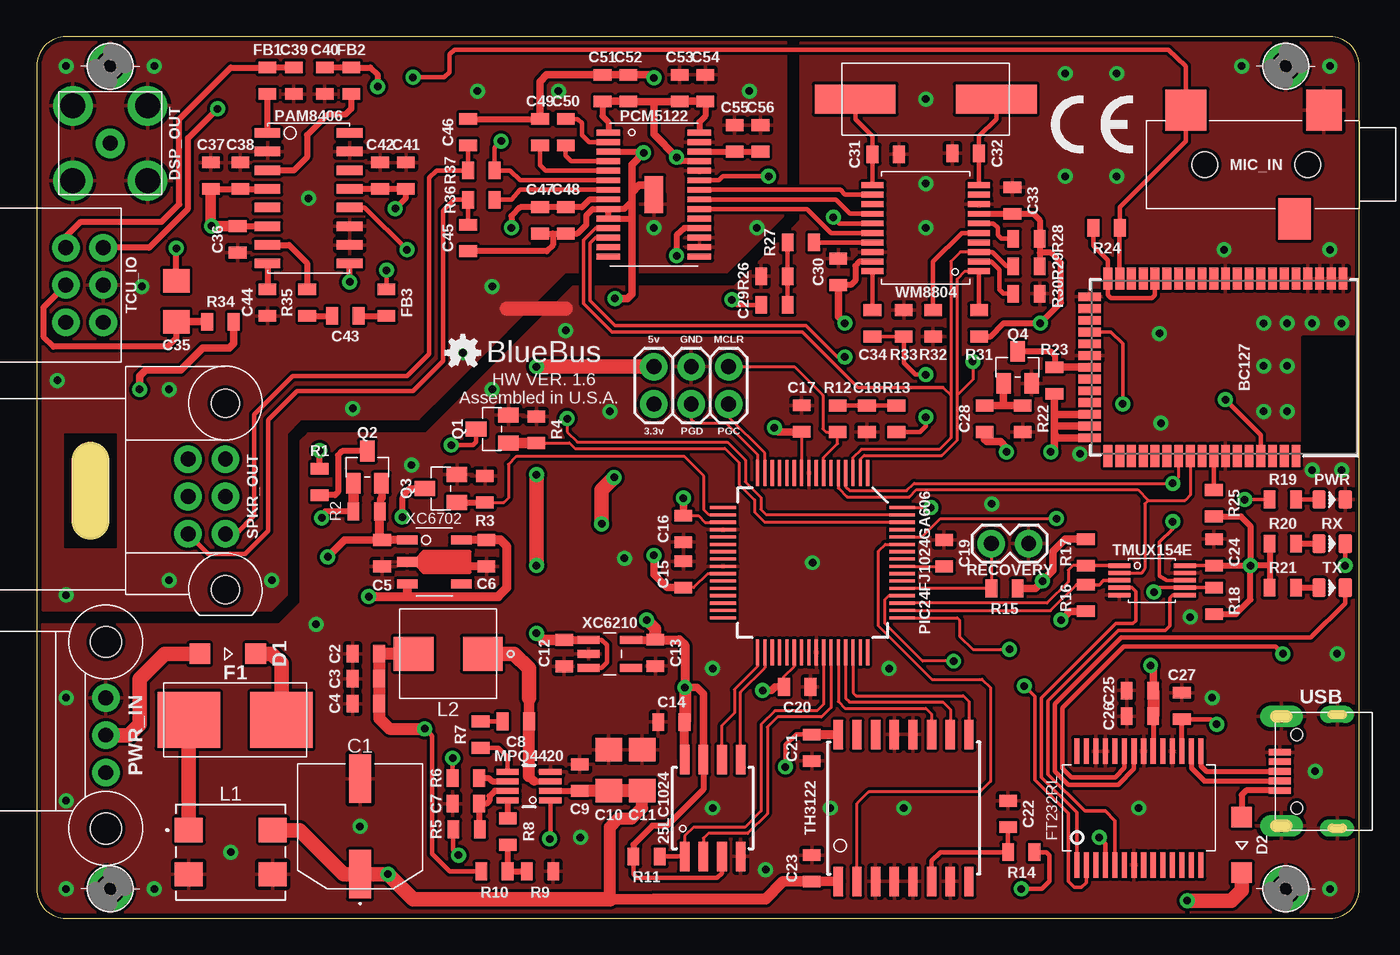
[diagram p5: board, top side]
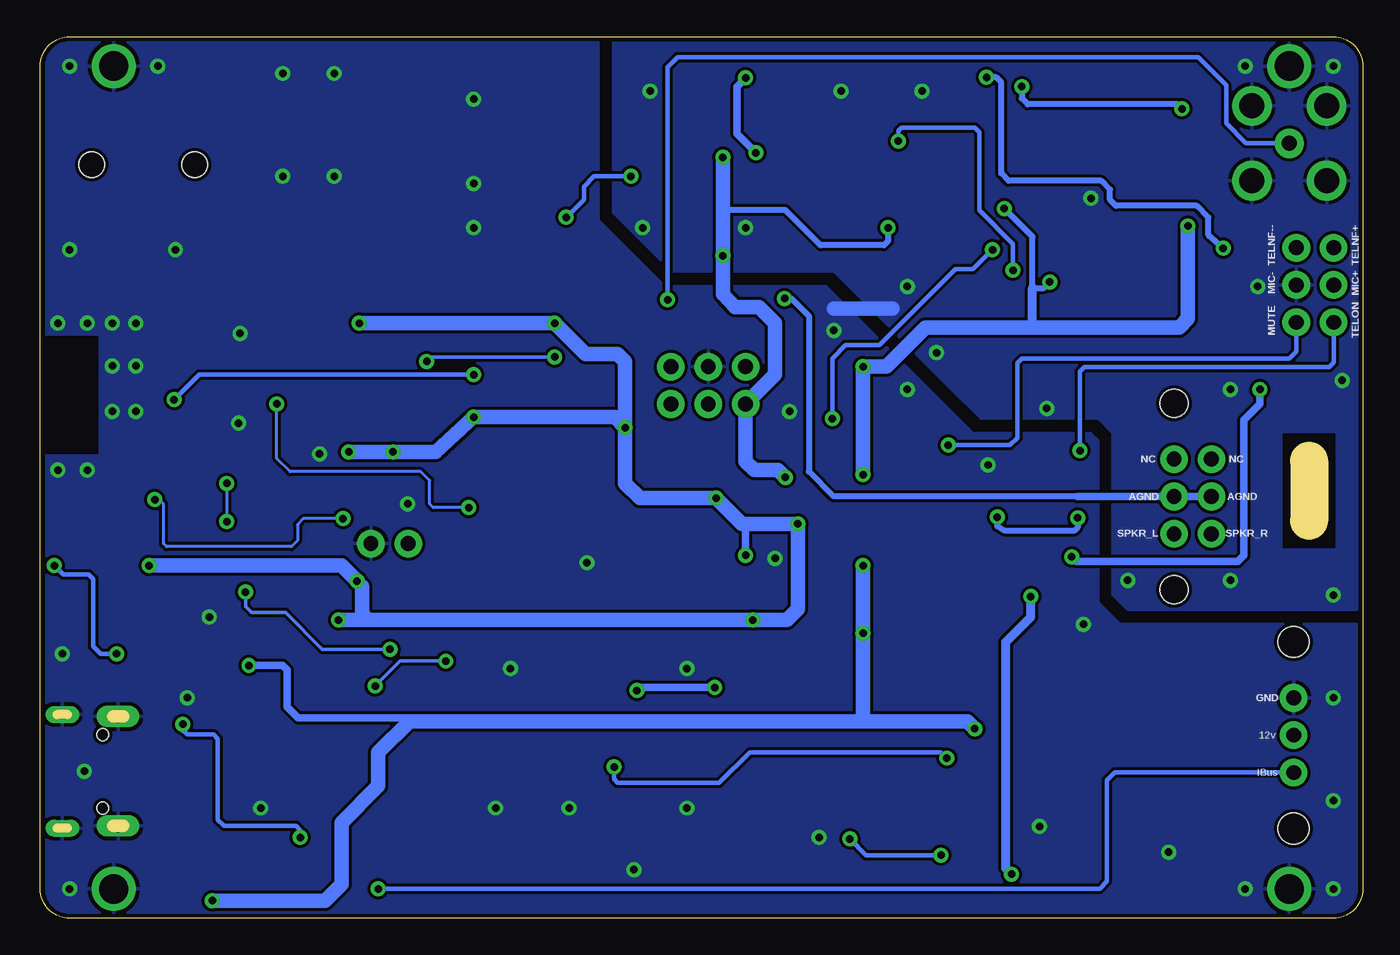
[diagram p6: board, bottom side, seen from below]

Size 90 x 60 mm. Coordinates in mm from the lower left corner, seen from the top.
Outline: 0,58 0,2 arc90 2,0 88,0 arc90 90,2 90,58 arc90 88,60 2,60 arc90 0,58
Copper layers (1*16): Top 0.035mm / dielectric 1.5mm / Bottom 0.035mm
Design rules "SparkFun": minimum track width 8mil, minimum drill 20mil, track to track 8mil, track to pad 8mil, pad to pad 7mil, via to via 8mil, smd to smd 7mil, copper to edge 10mil, drill to drill 8mil, minimum pad ring 12mil, minimum via ring 10mil, stop-mask expansion 4mil, vias tented up to drill 0.52mm, thermal gap 10mil

### Footprints (pad centres in the part's own frame; a part is rotated, then mirrored left to right if it is on the bottom)
SOIJ-8 = smd 0.65 x 2: 1 -1.905,-3.3; 2 -0.635,-3.3; 3 0.635,-3.3; 4 1.905,-3.3; 5 1.905,3.3; 6 0.635,3.3; 7 -0.635,3.3; 8 -1.905,3.3
BC127 = smd 1.5 x 0.6: 1 -6.05,8.1; 2 -6.05,7.3; 3 -6.05,6.5; 4 -6.05,5.7; 5 -6.05,4.9; 6 -6.05,4.1; 7 -6.05,3.3; 8 -6.05,2.5; 9 -6.05,1.7; 10 -6.05,0.9; 11 -6.05,0.1; 12 -6.05,-0.7; 13 -6.05,-1.5; 14 -6.05,-2.3; 15 -6.05,-3.1; 16 -6.05,-3.9; 17 -6.05,-4.7; 18 -6.05,-5.5; 19 -6.05,-6.3; 20 -6.05,-7.1; 21 -6.05,-7.9; 35 6.05,-7.9; 36 6.05,-7.1; 37 6.05,-6.3; 38 6.05,-5.5; 39 6.05,-4.7; 40 6.05,-3.9; 41 6.05,-3.1; 42 6.05,-2.3; 43 6.05,-1.5; 44 6.05,-0.7; 45 6.05,0.1; 46 6.05,0.9; 47 6.05,1.7; 48 6.05,2.5; 49 6.05,3.3; 50 6.05,4.1; 51 6.05,4.9 | smd 0.6 x 1.5: 22 -4.8,-9.15; 23 -4,-9.15; 24 -3.2,-9.15; 25 -2.4,-9.15; 26 -1.6,-9.15; 27 -0.8,-9.15; 28 0,-9.15; 29 0.8,-9.15; 30 1.6,-9.15; 31 2.4,-9.15; 32 3.2,-9.15; 33 4,-9.15; 34 4.8,-9.15
RHS1V101MCN1GS = smd 3.3 x 1.5: 1 -3.25,0; 2 3.25,0
0805 = smd 0.8 x 1.2: 1 -0.9,0; 2 0.9,0
1206 = smd 1.6 x 1.8: 1 -1.4,0; 2 1.4,0
SOD123 = smd 1.4 x 1.4: A 1.9,0; C -1.9,0
MOLEX_SMB = drill 1.7 pad 2.7: 1 -2.54,2.54; 2 2.54,2.54; 3 2.54,-2.54; 4 -2.54,-2.54 | drill 1 pad 2: P$1 0,0
LITTLEFUSE = smd 3.81 x 4.242: IN 0,3.151; OUT 0,-3.151
SSOP28 = smd 0.35 x 1.75: 1 -4.225,-3.875; 2 -3.575,-3.875; 3 -2.925,-3.875; 4 -2.275,-3.875; 5 -1.625,-3.875; 6 -0.975,-3.875; 7 -0.325,-3.875; 8 0.325,-3.875; 9 0.975,-3.875; 10 1.625,-3.875; 11 2.275,-3.875; 12 2.925,-3.875; 13 3.575,-3.875; 14 4.225,-3.875; 15 4.225,3.875; 16 3.575,3.875; 17 2.925,3.875; 18 2.275,3.875; 19 1.625,3.875; 20 0.975,3.875; 21 0.325,3.875; 22 -0.325,3.875; 23 -0.975,3.875; 24 -1.625,3.875; 25 -2.275,3.875; 26 -2.925,3.875; 27 -3.575,3.875; 28 -4.225,3.875
2.0-PAD = drill 2 pad 3: B2,0 0,0
ACM70V-701-2PL-TL00 = smd 1.905 x 1.651: 1 -2.857,1.5; 2 -2.857,-1.5; 3 2.857,-1.5; 4 2.857,1.5
PCC-M0648M-LE = smd 2.7 x 2.3: 1 -2.35,0; 2 2.35,0
AUDIO-CUI-SJ-352X-SMT = smd 2.2 x 2.8: RING 4.4,3.7 | smd 2.4 x 2.8: SLEEVE 2.4,-3.7 | smd 2.8 x 2.8: TIP 11.8,-3.7 | hole 1.75: 3.5,0; 10.5,0
TSOT23-8 = smd 0.4 x 1.5: 1 -0.975,-1.45; 2 -0.325,-1.45; 3 0.325,-1.45; 4 0.975,-1.45; 5 0.975,1.45; 6 0.325,1.45; 7 -0.325,1.45; 8 -0.975,1.45
SOP-16 = smd 0.65 x 1.75: 1 -4.45,-2.8; 2 -3.18,-2.8; 3 -1.91,-2.8; 4 -0.64,-2.8; 5 0.63,-2.8; 6 1.9,-2.8; 7 3.17,-2.8; 8 4.44,-2.8; 9 4.44,2.8; 10 3.17,2.8; 11 1.9,2.8; 12 0.63,2.8; 13 -0.64,2.8; 14 -1.91,2.8; 15 -3.18,2.8; 16 -4.45,2.8
TSSOP28 = smd 1.6 x 0.4: 1 -3.1,4.225; 2 -3.1,3.575; 3 -3.1,2.925; 4 -3.1,2.275; 5 -3.1,1.625; 6 -3.1,0.975; 7 -3.1,0.325; 8 -3.1,-0.325; 9 -3.1,-0.975; 10 -3.1,-1.625; 11 -3.1,-2.275; 12 -3.1,-2.925; 13 -3.1,-3.575; 14 -3.1,-4.225; 15 3.1,-4.225; 16 3.1,-3.575; 17 3.1,-2.925; 18 3.1,-2.275; 19 3.1,-1.625; 20 3.1,-0.975; 21 3.1,-0.325; 22 3.1,0.325; 23 3.1,0.975; 24 3.1,1.625; 25 3.1,2.275; 26 3.1,2.925; 27 3.1,3.575; 28 3.1,4.225
TQFP64 = smd 0.22 x 1.75: 1 -3.75,-6.1; 2 -3.25,-6.1; 3 -2.75,-6.1; 4 -2.25,-6.1; 5 -1.75,-6.1; 6 -1.25,-6.1; 7 -0.75,-6.1; 8 -0.25,-6.1; 9 0.25,-6.1; 10 0.75,-6.1; 11 1.25,-6.1; 12 1.75,-6.1; 13 2.25,-6.1; 14 2.75,-6.1; 15 3.25,-6.1; 16 3.75,-6.1; 33 3.75,6.1; 34 3.25,6.1; 35 2.75,6.1; 36 2.25,6.1; 37 1.75,6.1; 38 1.25,6.1; 39 0.75,6.1; 40 0.25,6.1; 41 -0.25,6.1; 42 -0.75,6.1; 43 -1.25,6.1; 44 -1.75,6.1; 45 -2.25,6.1; 46 -2.75,6.1; 47 -3.25,6.1; 48 -3.75,6.1 | smd 1.75 x 0.22: 17 6.1,-3.75; 18 6.1,-3.25; 19 6.1,-2.75; 20 6.1,-2.25; 21 6.1,-1.75; 22 6.1,-1.25; 23 6.1,-0.75; 24 6.1,-0.25; 25 6.1,0.25; 26 6.1,0.75; 27 6.1,1.25; 28 6.1,1.75; 29 6.1,2.25; 30 6.1,2.75; 31 6.1,3.25; 32 6.1,3.75; 49 -6.1,3.75; 50 -6.1,3.25; 51 -6.1,2.75; 52 -6.1,2.25; 53 -6.1,1.75; 54 -6.1,1.25; 55 -6.1,0.75; 56 -6.1,0.25; 57 -6.1,-0.25; 58 -6.1,-0.75; 59 -6.1,-1.25; 60 -6.1,-1.75; 61 -6.1,-2.25; 62 -6.1,-2.75; 63 -6.1,-3.25; 64 -6.1,-3.75
2X3 = drill 1.016 pad 1.88: 1 0,0; 2 0,2.54; 3 2.54,0; 4 2.54,2.54; 5 5.08,0; 6 5.08,2.54
LED-0805 = smd 0.889 x 1.27: + -0.889,0; - 0.889,0
TE_MQS_3PIN = drill 1 pad 1.88: 1 0,0; 2 2.54,0; 3 5.08,0 | hole 2.1: -3.81,0; 8.89,0
SOT-23 = smd 1 x 1.4: 1 -0.95,-1.1; 2 0.95,-1.1; 3 0,1.1
1X02 = drill 1.016 pad 1.88: 1 0,0; 2 2.54,0
SHORT_TOP-50 = smd 1.27 x 1.27: 1 0.635,0; 2 -0.635,0
TE_MQS_6PIN = drill 1.016 pad 1.88: 1 5.08,2.54; 2 2.54,2.54; 3 0,2.54; 4 5.08,0; 5 2.54,0; 6 0,0 | hole 1.9: -3.81,2.54; 8.89,2.54
TE_AMPMODU_6_PIN = drill 1.016 pad 1.88: 1 -2.54,-1.27; 2 -2.54,1.27; 3 0,-1.27; 4 0,1.27; 5 2.54,-1.27; 6 2.54,1.27
SOIC16DF = smd 0.635 x 2: 1 -4.45,-5; 2 -3.18,-5; 3 -1.91,-5; 4 -0.64,-5; 5 0.63,-5; 6 1.9,-5; 7 3.17,-5; 8 4.44,-5; 9 4.44,5; 10 3.17,5; 11 1.9,5; 12 0.63,5; 13 -0.64,5; 14 -1.91,5; 15 -3.18,5; 16 -4.45,5
VSSOP10 = smd 1.5 x 0.3: 1 -2.225,1; 2 -2.225,0.5; 3 -2.225,0; 4 -2.225,-0.5; 5 -2.225,-1; 6 2.225,-1; 7 2.225,-0.5; 8 2.225,0; 9 2.225,0.5; 10 2.225,1
629105150521 = smd 0.45 x 1.5: 1 -1.3,3.9; 2 -0.65,3.9; 3 0,3.9; 4 0.65,3.9; 5 1.3,3.9 | drill 0.85 pad 0.95 long: Z1 -3.725,3.8; Z2 3.725,3.8 | drill 0.55 pad 0.9 long: Z3 3.875,0; Z4 -3.875,0 | hole 0.8: -2.5,2.75; 2.5,2.75
SSOP20 = smd 0.4 x 1.5: 1 -2.955,-3.625; 2 -2.305,-3.625; 3 -1.655,-3.625; 4 -1.005,-3.625; 5 -0.355,-3.625; 6 0.295,-3.625; 7 0.945,-3.625; 8 1.595,-3.625; 9 2.245,-3.625; 10 2.895,-3.625; 11 2.895,3.625; 12 2.245,3.625; 13 1.595,3.625; 14 0.945,3.625; 15 0.295,3.625; 16 -0.355,3.625; 17 -1.005,3.625; 18 -1.655,3.625; 19 -2.305,3.625; 20 -2.955,3.625
HC49 = smd 5.5 x 2: 1 -4.8,0; 2 4.8,0
SOT23-5 = smd 0.55 x 1.5: 1 -0.95,-1.45; 2 0,-1.45; 3 0.95,-1.45; 4 0.95,1.45; 5 -0.95,1.45
SOT-89-5 = smd 0.6 x 1.4: 1 -1.499,-1.781; 3 1.499,-1.781; 4 1.499,1.894; 5 -1.499,1.894 | smd 0.65 x 1.4: 2 0,-1.781

### Placement (x,y rotation side)
25LC1024  46,7.5 0 top
BC127  80.8,37.5 270 top
C1  22,6.25 90 top
C2  22.4,18 180 top
C3  22.4,16.3 180 top
C4  22.4,14.6 180 top
C5  23.5,24.85 270 top
C6  30.6,24.85 270 top
C7  29.2,7.8 180 top
C8  32.6,13.4 0 top
C9  36.95,9.57 90 top
C10  38.92,10.07 90 top
C11  41.2,10.07 90 top
C12  35.9,18.05 270 top
C13  42.1,18.06 270 top
C14  43.19,13.35 180 top
C15  44,23.4 270 top
C16  44,26.5 90 top
C17  52.05,34.01 270 top
C18  56.5,34 270 top
C19  61.75,24.84 90 top
C20  51.75,15.75 180 top
C21  52.75,11.6 90 top
C22  66.1,7.1 90 top
C23  52.75,3.4 90 top
C24  80.12,24.9 90 top
C25  75.08,15.5 180 top
C26  75.08,13.75 180 top
C27  77.92,14.45 90 top
C28  64.5,34 90 top
C29  50.2,41.75 0 top
C30  54.55,44 90 top
C31  57.78,52 0 top
C32  63.22,52.06 180 top
C33  66.4,48.85 90 top
C34  56.88,40.5 270 top
C35  9.5,42 270 top
C36  13.67,46.21 270 top
C37  11.85,50.54 90 top
C38  13.85,50.54 90 top
C39  17.5,57 270 top
C40  19.6,57 270 top
C41  25.13,50.54 90 top
C42  23.37,50.54 90 top
C43  21,41 180 top
C44  15.7,41.9 270 top
C45  29.35,46.3 270 top
C46  29.35,53.5 90 top
C47  34.25,47.5 270 top
C48  36,47.5 270 top
C49  34.25,53.5 270 top
C50  36,53.5 270 top
C51  38.5,56.5 90 top
C52  40.25,56.5 90 top
C53  43.75,56.5 90 top
C54  45.5,56.5 90 top
C55  47.5,53.08 90 top
C56  49.25,53.08 90 top
CE  [CE-4MM]  69,52 0 top
D1  13,18 180 top
D2  82,5 90 top
DSP_OUT  5,52.75 180 top
F1  13.5,13.5 270 top
FB1  15.7,57 90 top
FB2  21.4,57 90 top
FB3  23.8,41.9 270 top
FRAME1  45,61 0 top
FRAME2  45,61 0 top
FRAME3  45,61 0 top
FRAME4  45,61 0 top
FRAME5  45,61 0 top
FT232RL  75,7.5 0 top
H1  5,2 0 top
H2  5,58 0 top
H3  85,2 0 top
H4  85,58 0 top
L1  13.2,4.5 0 top
L2  28,18 180 top
MIC_IN  90,51.3 180 top
MPQ4420  33.5,9 90 top
OSHW  [OSHW-LOGO-MINI]  29,38.5 0 top
PAM8406  18.5,49 270 top
PCM5122  42,49.25 0 top
PIC24FJ1024GA606  52.8,24.2 180 top
PICKIT  42,35 0 top
PWR  88.15,28.5 0 top
PWR_IN  4.7,15 270 top
Q1  31,33.3 90 top
Q2  22.5,30.7 0 top
Q3  27.5,29.25 90 top
Q4  66.75,37.5 0 top
R1  19.25,29.7 90 top
R2  22.45,27.69 0 top
R3  30.5,29.2 270 top
R4  34,33.25 270 top
R5  29.25,6.05 0 top
R6  29.2,9.55 180 top
R7  30.2,12.5 90 top
R8  32.05,5.9 90 top
R9  34.25,3.2 180 top
R10  31.15,3.2 180 top
R11  41.5,4.2 180 top
R12  54.5,34 270 top
R13  58.5,34 90 top
R14  67,4.5 180 top
R15  65.86,22.45 0 top
R16  71.4,21.8 270 top
R17  71.4,24.9 270 top
R18  80.12,21.6 270 top
R19  84.8,28.5 180 top
R20  84.8,25.5 180 top
R21  84.8,22.5 180 top
R22  67.1,34 90 top
R23  69.25,36.6 90 top
R24  72.81,47 180 top
R25  80.1,28.25 270 top
R26  50.2,43.7 0 top
R27  52,46 0 top
R28  67.35,46.25 180 top
R29  67.35,44.38 180 top
R30  67.35,42.5 180 top
R31  64.13,40.5 90 top
R32  61,40.5 90 top
R33  59,40.5 270 top
R34  12.5,40.6 180 top
R35  18.4,41.9 90 top
R36  30.25,48.9 180 top
R37  30.25,50.9 180 top
RECOVERY  67.5,25.5 180 top
RX  88.15,25.5 0 top
SH1  42,49.25 270 top
SPKR_OUT  10.3,31.25 270 top
TCU_IO  3.25,43.1 270 top
TH3122  59,7.5 0 top
TMUX154E  75.9,23 0 top
TX  88.15,22.5 0 top
USB  88.5,10 90 top
WM8804  60.5,47 90 top
X1  60.5,55.75 180 top
XC6210  39,18 270 top
XC6702  27,24.25 270 top

### Tracks (layer width: path | path; a pad name or v marks a point on that pad's centre or on a via)
3.3V  (via drill 0.51)
  Top 0.22: C17.2 PIC24FJ1024GA606.10 | PIC24FJ1024GA606.38 51.55,17.15 50.85,16.45 C20.2 | C16.2 45.02,27.4 45.47,26.95 PIC24FJ1024GA606.19 | PIC24FJ1024GA606.26 45.65,23.45 44.7,22.5 C15.2
  Top 0.25: TMUX154E.10 C24.1
  Top 0.3: R13.1 60.1,33.1 60.5,33.5 v60.5,34.1 | 25LC1024.3 46.63,3.08 46.31,2.75 40.85,2.75 40.6,3 R11.2
  Top 0.4: R20.2 83.9,24.1 | 83.9,24.1 R21.2 | C24.1 v82.6,24 | v82.6,24 82.6,26.7 81.95,27.35 R25.2 | R18.2 81.6,20.7 82.6,21.7 v82.6,24 | 83.9,24.1 83.8,24 v82.6,24 | PCM5122.8 37.62,48.92 37.1,48.4 C48.1 C47.1 32.9,48.4 32.3,47.8 v32.3,47 | WM8804.7 C33.1 67.82,47.95 68.26,47.51 R28.1 68.25,45.3 | 68.25,45.3 R29.1 | 68.25,45.3 69,45.3 69.7,44.6 69.7,41.9 v68.3,40.5 65.8,40.5 64.9,39.6 R31.1 | WM8804.19 55.99,44.7 55.7,44.4 55.7,43.4 55.4,43.1 C30.1 | PCM5122.18 44.08,46.98 43.55,46.51 v43.55,45.1 | PCM5122.25 43.83,51.52 v43.55,51.8 | 25LC1024.7 45.37,8.77 42.9,6.3 41.9,6.3 40.6,5 R11.2 | C51.1 38.5,54.6 38.9,54.2 PCM5122.1 | PCM5122.28 45.1,54.2 45.5,54.6 C54.1
  Top 0.5: C17.2 50.49,33.11 v50.2,33.4 | C30.1 54.55,40.95 v55,40.5 | R17.1 70,25.8 69.16,24.96 69.16,23.66 v68.45,22.95 67.95,22.45 R15.2 | v49.4,15.5 50,15.5 50.25,15.75 C20.2 | C16.2 v44,28.6 | C15.2 42.9,22.5 42,23.4 v42,24.7 | v44.1,15.7 44.93,15.7 45.37,15.26 25LC1024.7 | R16.2 70.3,20.9 v69.7,20.3 | v43.55,51.8 42,53.38 42,55.59 | 42,55.59 C52.1 C51.1 | 42,55.59 C53.1 C54.1 | 69.25,33.5 BC127.33 | 69.25,33.5 69.25,32.95 | C28.1 64.5,32.6 64.65,32.45 65.57,32.45 66,32.02 v66,31.75 | R23.1 69.25,34.3 | 69.25,34.3 69.25,33.5 | BC127.32 69.25,34.3 | BC127.34 69.5,32.7 69.25,32.95 | 69.25,32.95 69.25,32 v69,31.75
  Top 0.55: C13.1 XC6210.5
  Top 0.6: C13.1 43.74,18.96 44.1,18.6 v44.1,15.7 | 25LC1024.8 C14.1
  Top 0.8: C13.1 42.1,19.7 v41.5,20.3 | v44.1,15.7 C14.1
  Top 1: v39.3,30 38.45,29.15 v38.45,26.85
  Bottom 0.4: v32.3,47 32.3,46.1 32.6,45.8 36.9,45.8 39.3,48.2 43.55,48.2
  Bottom 0.5: v49.4,15.5 49.2,15.7 v44.1,15.7 | v42,24.7 42,26.6 42.25,26.85
  Bottom 1: v50.2,33.4 50.9,34.1 v60.5,34.1 63.1,31.75 v66,31.75 v69,31.75 | v50.2,33.4 50.2,37.9 50.7,38.4 52.9,38.4 v55,40.5 v68.3,40.5 | v43.55,51.8 43.55,48.2 v43.55,45.1 43.55,42.5 42.71,41.6 41.1,41.6 40,40.5 40,37 PICKIT.1 42,31.1 41.4,30.5 39.8,30.5 v39.3,30 | v50.2,33.4 50.2,29.6 49.2,28.6 v44,28.6 42.25,26.85 v38.45,26.85 v38.44,26.84 38.44,21.06 39.2,20.3 v41.5,20.3 67.7,20.3 | 67.7,20.3 68.1,20.7 68.1,22.6 v68.45,22.95 69.5,24 v82.6,24 | 67.7,20.3 v69.7,20.3
5V  (via drill 0.51)
  Top 0.3: R10.2 28.1,3.2 26.9,4.4 26.9,12.4 v26.4,12.9 | XC6210.1 38.45,18.95 38.8,18.6 38.8,17.4 38.45,17.05 XC6210.3
  Top 0.35: C26.1 FT232RL.20
  Top 0.4: C37.1 C38.1 PAM8406.4 | C36.1 PAM8406.6 | PAM8406.13 C42.1 C41.1 25.13,49.03 v24.4,48.3 | v21.3,43.3 PAM8406.9
  Top 0.5: C25.1 75.97,17.02 v75.8,17.2
  Top 0.55: C12.1 XC6210.1
  Top 0.7: C36.1 v11.89,47.11 11.85,47.15 C37.1 | C12.1 34.45,18.95 v34,19.4
  Top 0.8: v26.4,12.9 24,12.9 23.3,13.6 C4.1 C3.1 C2.1 L2.2 | C25.1 C26.1
  Top 1: PICKIT.2 v34,37.54 | D2.C 82,1.9 81.3,1.2 v78.3,1.2 | v34,24 v34,30.2
  Bottom 0.4: v24.4,48.3 22.48,46.38 22.48,42.9 21.7,42.9 v21.3,43.3
  Bottom 0.5: v75.8,17.2 73.5,17.2 73.2,16.9 73.2,14.4 72.45,13.65 64.75,13.65 64.5,13.4
  Bottom 0.6: 22.48,40.2 22.48,42.9
  Bottom 1: v78.3,1.2 70.6,1.2 69.5,2.3 69.5,6.5 67,9 67,11.28 64.88,13.4 64.5,13.4 33.7,13.4 | v11.89,47.11 11.89,40.81 12.5,40.2 22.48,40.2 29.75,40.2 32.41,37.54 v34,37.54 v34,30.2 | v26.4,12.9 26.9,13.4 33.7,13.4 | 33.7,13.4 34,13.7 v34,19.4 v34,24
5VREG_BS
  Top 0.3: R7.1 31.42,11.6 32.05,10.97 MPQ4420.5
5VREG_BS_CAP
  Top 0.3: R7.2 C8.1
5VREG_EN
  Top 0.4: R6.1 30.75,9.55 30.98,9.32 MPQ4420.6
5VREG_FB
  Top 0.4: MPQ4420.8 R8.2
5VREG_FB_T
  Top 0.4: R8.1 R10.1 R9.2
5VREG_PG  (via drill 0.51)
  Top 0.3: MPQ4420.1 34.95,5.45 v34.9,5.4 | R5.1 28.35,4.65 v28.7,4.3
  Bottom 0.3: v28.7,4.3 33.8,4.3 v34.9,5.4
5VREG_SW
  Top 0.4: 33.85,9.32 MPQ4420.3
  Top 0.6: 33.85,9.32 33.5,9.67
  Top 0.7: C8.2 33.5,15
  Top 0.8: 33.5,9.67 C8.2
  Top 1: 33.5,15 33.5,17 32.5,18 L2.1
5VREG_VCC
  Top 0.4: MPQ4420.7 31.18,8.68 30.8,8.3 30.8,8 30.6,7.8 C7.1 30.1,6.1 R5.2
12V  (via drill 0.51)
  Top 0.5: R2.2 23.39,28.52 23.49,28.62 Q2.2 | C5.1 20.95,25.75 v19.8,24.6 | v7,36 7,36.9 7.4,37.3 9.8,37.3 11.3,38.8 13.1,38.8 13.4,39.1 R34.1
  Top 0.55: XC6702.1 C5.1
  Top 0.6: C5.1 23.35,25.86 R2.2
  Bottom 0.5: v19.8,24.6 19.5,24.3 8.5,24.3 8.1,24.7 8.1,33.9 7,35 v7,36
AGND  (via drill 0.51)
  Top 0.4: C47.2 35.12,46.6 | 35.12,46.6 C48.2 36.8,46.6 37.4,47.2 37.4,47.85 37.83,48.27 PCM5122.9 | C45.2 34.7,45.4 35.12,45.83 35.12,46.6 | 40.5,48.8 39.98,48.27 PCM5122.9 | C46.2 C49.1 | PCM5122.9 PCM5122.10 40.48,47.62 40.5,47.6 | PCM5122.3 41.23,52.17 v41.3,52.1
  Top 0.5: SH1.2 40.98,49.88 40.5,49.4 | 40.5,49.4 40.5,48.8 40.5,47.6 40.5,42.49 40.2,42.19 v39.34,42.19 | 40.5,49.4 40.5,51.3 v41.3,52.1 | v42,57.2 41.8,57.4 C52.2 C51.2 34.7,57.4 34.25,56.95 C49.1
  Bottom 0.4: v39.34,42.19 38.89,42.19 37.7,41 37.7,30.4 36.01,28.71 19.41,28.71
  Bottom 0.5: SPKR_OUT.5 SPKR_OUT.2 19.41,28.71 | v41.3,52.1 42.6,53.4 42.6,56.6 v42,57.2
BT_DATA_IO  (via drill 0.51)
  Top 0.22: PIC24FJ1024GA606.64 v60.85,27.95
  Top 0.25: v73.9,35 73.9,39.1 73.1,39.9 BC127.25
  Bottom 0.22: v60.85,27.95 63.25,27.95 63.5,28.2 63.5,29.8 64.1,30.4 73,30.4 73.9,31.3 v73.9,35
BT_DOUT  (via drill 0.51)
  Top 0.25: C34.2 R33.2
  Top 0.3: BC127.48 83.3,32.9 v80.9,35.3 | R33.2 59,37.8 59.8,37 v60.5,37
  Bottom 0.3: v80.9,35.3 79.2,37 v60.5,37
BT_MIC_BIAS
  Top 0.3: BC127.17 76.1,42.4 75.9,42.2 73.1,42.2 72.9,42.4 BC127.21 72.9,44.8 71.91,45.79 R24.2
BT_MIC_L  (via drill 0.51)
  Top 0.25: 78.2,55.1 MIC_IN.TIP
  Top 0.3: 78.2,55.1 78.2,58 77.02,59.12 28.43,59.12 28.1,58.8 28.1,57.6 27.74,57.24 v25.6,57.24 | BC127.20 73.68,43.32 73.68,47.27 R24.1 73.71,48.4 78.2,52.89 MIC_IN.TIP
  Top 0.4: C35.1 v9.5,45.6
  Bottom 0.4: v9.5,45.6 10.5,46.5 10.5,47.7 11.3,48.5 16.8,48.5 17.2,48.9 17.2,49.6 17.8,50.2 24.1,50.2 24.6,50.7 24.6,56.9 24.94,57.24 v25.6,57.24
BT_RST
  Top 0.3: BC127.44 R25.1
BT_URX
  Top 0.22: PIC24FJ1024GA606.5 54.55,29.27 55.15,28.68 59.38,28.68 59.87,29.17 74.93,29.17 75.65,28.45 | TMUX154E.2 75.2,23.5 75.4,23.8 75.4,28.2 75.65,28.45 | BC127.42 78.5,28.8 78.15,28.45 75.65,28.45
BT_UTX  (via drill 0.51)
  Top 0.22: PIC24FJ1024GA606.4 55.05,29.37 55.32,29.1 59.2,29.1 59.7,29.6 v77.3,29.6 77.7,30 BC127.41
  Top 0.25: TMUX154E.8 76.9,23 76.4,23.3 76.4,25.6 77.3,26.5 v77.3,27
  Bottom 0.22: v77.3,29.6 v77.3,27
BT_VREGEN
  Top 0.4: Q4.3 69,38.6 69.3,38.3 69.3,37.5
  Top 0.5: BC127.28 69.3,37.5 R23.2
BT_VREGEN_CAP_GATE
  Top 0.5: C28.2 65.8,34.9 | 65.8,34.9 R22.2 | Q4.1 65.8,34.9
DAC_CAPM
  Top 0.3: PCM5122.4 36.38,51.52 36,51.9 C50.2
DAC_CAPP
  Top 0.3: PCM5122.2 37.58,52.83 37.1,53.3 37.1,54.1 36.8,54.4 C50.1
DAC_LDOO
  Top 0.4: PCM5122.26 C55.1 C56.1
DAC_OUT_L  (via drill 0.51)
  Top 0.3: PCM5122.6 32.88,50.23 32.2,50.9 R37.1 31.15,52.45 v31.6,52.9 | v23.8,44.1 FB3.1
  Bottom 0.3: v23.8,44.1 23.8,45.9 26.1,48.2 26.1,53.5 26.4,53.8 31.4,53.8 31.6,53.6 v31.6,52.9
DAC_OUT_R
  Top 0.3: R36.1 32.3,48.9 32.88,49.58 PCM5122.7
DAC_VNEG
  Top 0.3: PCM5122.5 34.62,50.88 34.25,51.25 C49.2
EE_CS
  Top 0.22: PIC24FJ1024GA606.42 53.55,14.57 53.11,14.13 50.23,14.13 49.3,13.2 49.3,7.3 48.2,6.2 44.7,6.2 44.09,5.59 44.09,4.3 25LC1024.1
  Top 0.3: 44.09,4.3 43.99,4.2 R11.1
EE_SCK
  Top 0.22: PIC24FJ1024GA606.33 49.05,17.15 47.48,15.58 47.48,13.97 46.63,13.13 25LC1024.6
EE_SI
  Top 0.22: PIC24FJ1024GA606.34 49.55,17.05 47.91,15.41 25LC1024.5
EE_SO
  Top 0.22: PIC24FJ1024GA606.43 54.05,14.35 53.4,13.7 50.4,13.7 49.72,13.03 49.72,7.12 48.38,5.78 45.7,5.78 45.37,5.44 25LC1024.2
GND  (via drill 0.51, 0.51 pad 0.51)
  Top 0.55: C6.2 29,23.95 28.7,24.25 XC6702.2
  Top 1: 36,41.5 32,41.5
  Bottom 1: 32,41.5 36,41.5
  other vias: 60.5,47 48.5,56.3 83.5,37.6 1.4,36.6 2,22 59,7.5 75,7.5 88,2 8,58 8,2 82,58 86.8,40.5 88.8,40.5 86.8,30.5 88.8,30.5 80.8,45.5 9,23 9,36 2,2 2,58 54,7.5 52.8,24.2 87,10 88.5,18 80,15 83.5,40.5 83.5,34.5 70,50.5 73.5,50.5 70,57.5 73.5,57.5 60.5,55.75 60.5,50 58,17 88,58 65,28.2 31,43 39,34.5 36,40 30,56.3 29,38.5 16,23 42,47 35.5,56.3 49,47 2,15 2,8 76.4,39.8 76.5,33.7 18.5,49 46,7.5 49.6,3.3 37,5.5 22,6.25 13.2,4.5 88,45.5 7.15,43 19,20 40,24.5 31,36 25.5,30.85 46,17 21.5,34.7 78.5,20.5 85.1,40.5 85.1,37.6 85.1,34.5 71,31.6
  pour Bottom: 0.4,21 16,21 17,22 17,33 18,34 26,34 28,36 36,44 47,44 51,48 51,59.6 2,59.6 arc90 0.4,58
  pour Top: 0.4,21 16,21 17,22 17,33 18,34 26,34 28,36 36,44 47,44 51,48 51,59.6 2,59.6 arc90 0.4,58
  pour Bottom: 0.4,20 16,20 16.5,20 18,21.5 18,32.5 18.5,33 26.5,33 36.5,43 47.5,43 52,47.5 52,59.6 88,59.6 arc-90 89.6,58 89.6,39.75 86,39.75 86,31.5 89.6,31.5 89.6,2 arc-90 88,0.4 2,0.4 arc-90 0.4,2
  pour Top: 0.4,20 16,20 16.5,20 18,21.5 18,32.5 18.5,33 26.5,33 36.5,43 47.5,43 52,47.5 52,59.6 88,59.6 arc-90 89.6,58 89.6,39.75 86,39.75 86,31.5 89.6,31.5 89.6,2 arc-90 88,0.4 2,0.4 arc-90 0.4,2
I2S_CLK
  Top 0.3: WM8804.14 55.35,47.95 54.38,48.92 PCM5122.21
I2S_DOUT
  Top 0.3: WM8804.12 55.02,49.24 54.68,49.58 PCM5122.22
I2S_LRCK  (via drill 0.51)
  Top 0.3: WM8804.15 54.62,47.3 v54.21,47.71 | v49.8,50.5 46.7,50.5 46.42,50.23 PCM5122.23
  Bottom 0.3: v49.8,50.5 52.3,50.5 53,49.8 53,48.9 54.19,47.71 v54.21,47.71
I2S_SCK
  Top 0.3: PCM5122.20 52.42,48.27 54.05,46.65 WM8804.16
IBUS  (via drill 0.51)
  Top 0.3: R14.1 68.7,4.5 68.9,4.3 68.9,2.5 68.4,2 v67,2
  Bottom 0.3: PWR_IN.3 16.88,9.92 17.4,9.4 17.4,2.5 17.9,2 v67,2
IBUS_5V  (via drill 0.51)
  Top 0.3: R6.2 v28.3,10.9 | v50.95,10.3 50.95,11.8 51.7,12.5 C21.2
  Top 0.6: C21.2 TH3122.16
  Bottom 0.3: v28.3,10.9 28.7,11.3 41.7,11.3 43.8,9.2 50.7,9.2 50.95,9.5 v50.95,10.3
IBUS_EN
  Top 0.22: PIC24FJ1024GA606.59 57.75,25.45 57.29,24.99 57.29,19.89 60.91,16.27 64.33,16.27 64.9,15.7 64.9,9.31 64.19,8.6 56.6,8.6 55.82,7.82 TH3122.2
IBUS_FILT
  Top 0.3: C22.1 R14.2 61.5,4.5 60.9,3.9 TH3122.6
IBUS_URX
  Top 0.22: PIC24FJ1024GA606.45 55.05,14.97 55.3,14.72 61.68,14.72 62.17,14.23 TH3122.10
IBUS_USTA
  Top 0.22: PIC24FJ1024GA606.46 55.55,15.35 55.75,15.15 63.05,15.15 63.45,14.75 TH3122.9
IBUS_UTX
  Top 0.22: PIC24FJ1024GA606.44 54.55,14.75 55,14.3 60.5,14.3 60.9,13.9 TH3122.11
MCU_MCLR
  Top 0.22: PICKIT.6 51.56,37.54 53.5,35.6 53.5,33.3 53.7,33.1 R12.2 54.5,32.3 53.55,31.35 PIC24FJ1024GA606.7
MCU_MCLR_RES
  Top 0.3: R12.1 C18.1 R13.2
MCU_ON_LED  (via drill 0.51)
  Top 0.22: PIC24FJ1024GA606.60 60.25,25.95 61.5,27.2 v69.4,27.2
  Top 0.25: R19.2 v82.2,28.5
  Bottom 0.22: v69.4,27.2 72.1,27.2 72.5,26.8 72.5,25.7 72.9,25.3 81.4,25.3 81.6,25.5 81.6,28.2 81.9,28.5 v82.2,28.5
MCU_ON_LED_RES
  Top 0.3: R19.1 PWR.+
MCU_PGC
  Top 0.22: PIC24FJ1024GA606.15 49.55,31.65 47.08,34.12 PICKIT.5
MCU_PGD
  Top 0.22: PIC24FJ1024GA606.16 49.05,31.55 46.9,33.7 44.8,33.7 44.54,33.96 PICKIT.3
MCU_RECOV
  Top 0.22: RECOVERY.2 R15.1 PIC24FJ1024GA606.53
MCU_SCK3  (via drill 0.51)
  Top 0.22: PIC24FJ1024GA606.2 56.05,31.25 56.3,31.5 61.59,31.5 62.64,32.55 62.64,35.6 | 62.64,35.6 62.64,43.52 63.16,44.04 WM8804.1 | 62.64,35.6 63.7,36.66 v63.7,37.9
  Top 0.25: PCM5122.12 38.02,46.33 37.65,45.96 37.65,42.05 39.35,40.35 52.35,40.35 54.5,38.2 v55,38.2
  Top 0.3: WM8804.1 R31.2
  Bottom 0.25: v63.7,37.9 63.4,38.2 v55,38.2
MCU_SDA3
  Top 0.22: PIC24FJ1024GA606.3 55.55,31.35 56.12,31.92 61.42,31.92 62.2,32.7 62.2,35.6 | WM8804.3 62.84,45.34 62.2,44.7 62.2,35.6 | 61.67,36.13 62.2,35.6
  Top 0.25: PCM5122.11 38.03,46.98 37.2,46.15 37.2,41.85 39.15,39.9 52.1,39.9 55.87,36.13 61.67,36.13
  Top 0.3: WM8804.3 65.03,45.34 66,44.38 R29.2
MCU_TEL_MUTE
  Top 0.22: PIC24FJ1024GA606.62 49.55,26.95 48.85,27.65 48.85,28.47 47.79,29.53 47.79,31.01 46.83,31.98 36.62,31.98 36.25,32.35 R4.2
  Top 0.7: R4.2 Q1.1
MCU_TEL_ON
  Top 0.22: PIC24FJ1024GA606.18 45.75,27.45 45.4,27.8 45.4,30.1 44.05,31.45 32.65,31.45 32.1,30.9 32.1,28.6 31.8,28.3 R3.2
  Top 0.4: Q3.1 R3.2
MCU_URX
  Top 0.22: PIC24FJ1024GA606.50 68.99,20.95 70.74,22.7 R16.1
  Top 0.25: TMUX154E.3 72.6,23 72.3,22.7 R16.1
MCU_UTX  (via drill 0.51)
  Top 0.22: PIC24FJ1024GA606.49 62.65,20.45 62.8,20.3 62.8,19.2 63.7,18.3 v66.2,18.3
  Top 0.25: R18.1 TMUX154E.7 76.34,22.5 v76.04,22.2
  Bottom 0.25: v76.04,22.2 76.04,21.24 75.6,20.8 73.3,20.8 70.8,18.3 v66.2,18.3
MCU_VCAP
  Top 0.22: PIC24FJ1024GA606.56 C19.1
RX_LED  (via drill 0.51)
  Top 0.3: FT232RL.23 74.03,10.22 73.4,9.6 70.4,9.6 69.8,10.2 69.8,14.33 73.97,18.5 84.3,18.5 v84.8,18 | RX.- v89.04,24.01
  Bottom 0.3: v84.8,18 85.9,18 86.4,18.5 86.4,23.1 86.7,23.4 88.43,23.4 v89.04,24.01
RX_LED_RES
  Top 0.4: R20.1 RX.+
SPDIF_OUT  (via drill 0.51)
  Top 0.3: C29.1 47.65,41.75 v47.3,42.1
  Bottom 0.3: v47.3,42.1 47.3,57.94 46.64,58.6 11.2,58.6 9.3,56.7 9.3,54.1 7.95,52.75 DSP_OUT.P$1
SPDIF_RX
  Top 0.3: WM8804.20 C34.1
SPKR_OUT_L
  Top 0.3: C46.1 R37.2 27.2,50.9 26.7,50.4 26.7,47.2 26.7,38.4 25.2,36.9 17.4,36.9 14.8,34.3 14.8,27.4 13.57,26.17 SPKR_OUT.1
SPKR_OUT_R
  Top 0.3: SPKR_OUT.4 11.67,24.8 14.2,24.8 15.75,26.35 15.75,33.9 17.72,35.87 25.62,35.87 27.66,37.91 27.66,48.15 28.41,48.9 R36.2 C45.1
SYS_3V3  (via drill 0.51)
  Top 0.3: FT232RL.4 72.72,5.08 v72.3,5.5 | C27.1 79.9,13.55 v80.3,13.2
  Top 0.35: FT232RL.17 C27.1
  Bottom 0.3: v72.3,5.5 72.3,6 72.6,6.3 77.5,6.3 77.91,6.71 77.91,12.21 78.2,12.5 80,12.5 80.3,12.8 v80.3,13.2
SYS_DTR  (via drill 0.51)
  Top 0.22: PIC24FJ1024GA606.52 57.97,21.95 57.71,21.69 57.71,20.07 60.28,17.5 v62.4,17.5
  Top 0.25: FT232RL.2 71.42,2.42 71.1,2.1 70.6,2.1 70.2,2.5 70.2,7.13 67.91,9.42 67.91,15.09 v67.2,15.8
  Bottom 0.25: v67.2,15.8 65.5,17.5 v62.4,17.5
SYS_UART_SEL
  Top 0.22: PIC24FJ1024GA606.51 68.75,21.45 70.2,22.9 70.2,23.7 70.5,24 R17.2
  Top 0.25: TMUX154E.1 R17.2
SYS_URX
  Top 0.25: TMUX154E.6 77.3,22 77.1,21.8 77.1,19.9 76.8,19.6 73.62,19.6 68.82,14.8 68.82,9.79 71.31,7.3 72.71,7.3 73.38,6.63 FT232RL.5
SYS_USB_DN
  Top 0.35: USB.2 79.45,9.35 78.58,10.22 FT232RL.16
SYS_USB_DP
  Top 0.35: FT232RL.15 79.22,10.36 79.58,10 USB.3
SYS_UTX
  Top 0.25: TMUX154E.4 74.54,22.5 74.78,22.26 74.78,20.23 74.61,20.06 73.44,20.06 68.36,14.99 68.36,9.61 70.78,7.2 FT232RL.1
TEL_AMP_IN
  Top 0.4: C43.1 FB3.2
TEL_AMP_INL
  Top 0.4: PAM8406.7 17.17,45.83 18.4,44.6 R35.2
TEL_AMP_INL_CAP_RES
  Top 0.4: R35.1 C43.2
TEL_AMP_OUT_L+
  Top 0.4: PAM8406.1 FB1.1
TEL_AMP_OUT_L-
  Top 0.4: PAM8406.3 17.51,50.91 18.4,51.8 18.4,53.3 19.8,54.7 21,54.7 21.4,55.1 FB2.1
TEL_AMP_SHDN  (via drill 0.51)
  Top 0.22: v36.1,34 36.1,33.1 36.8,32.4 47,32.4 48.22,31.19 48.22,29.7 49.27,28.64 49.27,27.82 49.65,27.45 PIC24FJ1024GA606.63
  Top 0.3: PAM8406.12 22.33,48.37 v25.2,45.5
  Bottom 0.3: v36.1,34 36.1,38.1 35.2,39 32.9,39 27.72,44.18 26.52,44.18 v25.2,45.5
TEL_AMP_VREF
  Top 0.4: PAM8406.8 C44.1
TEL_MIC_L_OUT
  Top 0.4: TCU_IO.3 0.45,41.57 0.45,39.6 1.15,38.9 8.9,38.9 9.5,39.5 C35.2
  Top 0.5: C35.2 R34.2
TEL_MUTE_IO  (via drill 0.51)
  Top 0.3: Q1.3 29.9,32.4 29.7,32.2 v28.2,32.2
  Bottom 0.3: TCU_IO.6 4.52,38.58 5,38.1 23.2,38.1 23.5,37.8 23.5,32.7 24,32.2 v28.2,32.2
TEL_ON
  Top 0.4: Q2.3 20.79,31.79 20.5,31.5 20.5,29 20.3,28.8 R1.1
TEL_ON_EN  (via drill 0.51)
  Top 0.4: R2.1 19.64,27.69 19.4,27.36 v19.4,27.25 | Q3.3 25.35,29.25 24.88,28.6 v24.88,27.3
  Top 0.7: R2.1 Q2.1
  Bottom 0.4: v19.4,27.25 19.4,26.6 19.6,26.4 24.4,26.4 24.88,26.7 v24.88,27.3
TEL_ON_IO  (via drill 0.51)
  Top 0.4: R1.2 v19.25,31.82 v19.24,31.83
  Bottom 0.3: TCU_IO.5 1.98,37.81 2.29,37.5 18.94,37.5 19.24,37.2 v19.24,31.83
TEL_OUT_L+
  Top 0.4: TCU_IO.1 1.98,46.38 3,47.4 8.5,47.4 9.7,48.6 9.7,54.4 13.2,57.9 FB1.2 C39.1
TEL_OUT_L-  (via drill 0.51)
  Top 0.4: TCU_IO.2 7.64,45.64 10.3,48.3 10.3,53.1 v12.3,55.1 | C40.1 FB2.2 22.7,57.9 23.2,57.4 v23.2,56.6
  Bottom 0.4: v23.2,56.6 23.2,55.8 22.8,55.4 12.6,55.4 v12.3,55.1
TX_LED
  Top 0.3: FT232RL.22 74.67,10.16 73.61,9.1 70.19,9.1 69.3,9.99 69.3,14.59 73.81,19.1 86.7,19.1 89.04,21.44 TX.-
TX_LED_RES
  Top 0.4: R21.1 TX.+
USB_5V
  Top 0.4: USB.1 82.3,8.7 82,8.4 D2.A
VBAT
  Top 1: PWR_IN.2 6.26,12.46 7,13.2 7,16.3 8.7,18 D1.A
VBAT_DIODE
  Top 1: D1.C 16,18 16.65,17.35 F1.IN
VBAT_FUSE
  Top 1: L1.1 10.35,10 F1.OUT
VIN  (via drill 0.51)
  Top 0.4: MPQ4420.2 C9.1
  Top 0.55: C6.1 XC6702.5
  Top 0.6: C6.1 31.55,25.75 32,25.3 32,22.5 31.4,21.9 25.2,21.9 | XC6702.3 25.22,21.92 25.2,21.9 | v22.6,21.9 25.2,21.9
  Top 0.65: TH3122.1 C23.1
  Top 0.7: 50.8,2.5 C23.1 | 42,1.3 39,1.3
  Top 0.75: 50.8,2.5 49.6,1.3 42,1.3
  Top 0.8: C10.1 C9.1 | C11.1 41.2,7.5 40.5,6.8 39.6,6.8 39,6.2 39,1.3
  Top 0.9: C11.1 C10.1
  Top 1: 39,1.3 25.6,1.3 v23.9,3 C1.1 20.9,3 17.9,6 L1.4
  Bottom 0.6: v23.9,3 24.3,3.4 24.3,18.8 22.6,20.5 v22.6,21.9
WM_CSB
  Top 0.3: R32.2 61,44.7 62.95,46.65 WM8804.5
WM_GPO0
  Top 0.3: R30.2 65.8,42.5 65.5,42.8 65.5,44.15 64.95,44.7 WM8804.2
WM_RESETB
  Top 0.3: WM8804.6 65.11,47.3 65.4,47 65.4,46.5 65.65,46.25 R28.2
WM_SPDIF_TX_RES
  Top 0.3: WM8804.17 R27.2
WM_SPDIF_TX_RES2
  Top 0.3: R27.1 R26.2 C29.2
WM_XIN
  Top 0.3: WM8804.11 C31.1 56.88,53.23 55.7,54.4 X1.2
WM_XOP
  Top 0.3: WM8804.10 C32.1 64.12,53.23 64.13,53.23 65.3,54.4 X1.1

### Text on the board
tNames: 5v | GND | MCLR | BlueBus | HW VER. 1.6 | Assembled in U.S.A. | 3.3v | PGD | PGC
bNames: TELNF+ | TELNF-- | MIC+ | MIC- | TELON | MUTE | NC | NC | AGND | AGND | SPKR_R | SPKR_L | GND | 12v | IBus
MfgOptions: Num. Layers | 2 | Board Dimms | 90mm x 60mm | Board Thickness | 1.6mm | Copper Oz | 1oz | Solder Sides | Both | Silkscreen Sides | Both | Silkscreen Color | White | Soldermask | Blue | Surface Finish | ENIG | SMD Pads | 468 | Min Track Width | 0.2mm | Min SMD Pitch | 0.1778mm | Min Hole Size | 0.51mm